# EAGLE design nano2 (EAGLE 8.3.0)

## Sheet 1 of 8
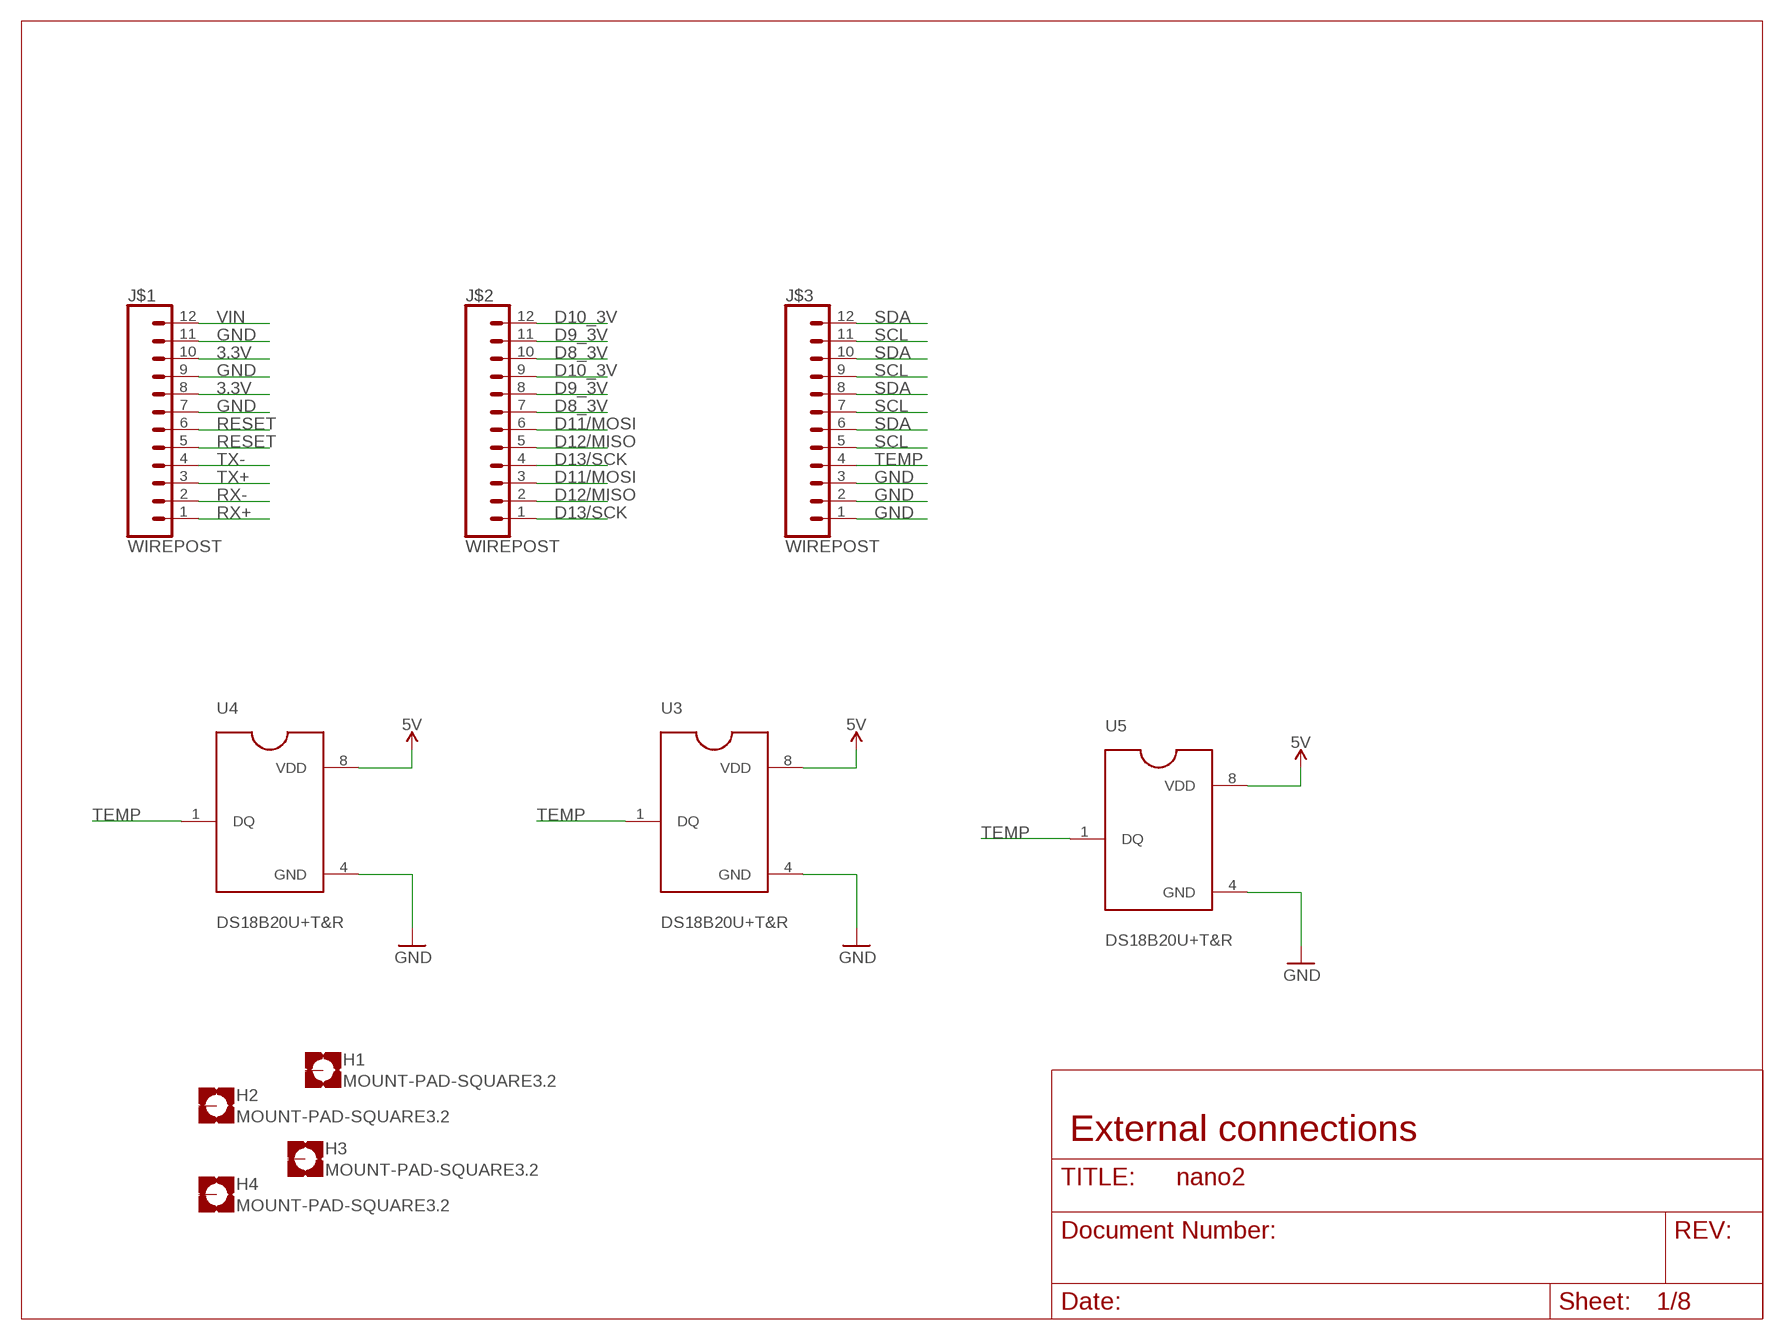
[diagram p0: schematic, sheet 1]

### Parts
H1  MOUNT-PAD-SQUARE3.2  [3,2-PAD-SQUARE]
H2  MOUNT-PAD-SQUARE3.2  [3,2-PAD-SQUARE]
H3  MOUNT-PAD-SQUARE3.2  [3,2-PAD-SQUARE]
H4  MOUNT-PAD-SQUARE3.2  [3,2-PAD-SQUARE]
J$1  WIREPOST  [WIREWRAPPOST]
J$2  WIREPOST  [WIREWRAPPOST]
J$3  WIREPOST  [WIREWRAPPOST]
U3  DS18B20U+T&R  [SOP65P500X110-8N]
U4  DS18B20U+T&R  [SOP65P500X110-8N]
U5  DS18B20U+T&R  [SOP65P500X110-8N]

### Nets
3.3V: J$1.8 J$1.10 ; also sheet 2,3,4,5,6,7,8
5V [power usb]: U3.8(VDD) U4.8(VDD) U5.8(VDD) ; supply symbol labelled POWER_5V ; also sheet 2,3,4,7,8
D8_3V: J$2.7 J$2.10 ; also sheet 7
D9_3V: J$2.8 J$2.11 ; also sheet 7
D10_3V: J$2.9 J$2.12 ; also sheet 7
D11/MOSI: J$2.3 J$2.6 ; also sheet 4,7
D12/MISO: J$2.2 J$2.5 ; also sheet 4,7
D13/SCK: J$2.1 J$2.4 ; also sheet 4,7
GND [gnd]: J$1.7 J$1.9 J$1.11 J$3.1 J$3.2 J$3.3 U3.4(GND) U4.4(GND) U5.4(GND) ; supply symbol labelled POWER_GND ; also sheet 2,3,4,5,6
RESET: J$1.5 J$1.6 ; also sheet 4
RX+: J$1.1 ; also sheet 2
RX-: J$1.2 ; also sheet 2
SCL: J$3.5 J$3.7 J$3.9 J$3.11 ; also sheet 4
SDA: J$3.6 J$3.8 J$3.10 J$3.12 ; also sheet 4
TEMP: J$3.4 U3.1(DQ) U4.1(DQ) U5.1(DQ)
TX+: J$1.3 ; also sheet 2
TX- [power]: J$1.4 ; also sheet 2
VIN [power]: J$1.12 ; also sheet 3
Unconnected: H1.B3,2(MOUNT) H2.B3,2(MOUNT) H3.B3,2(MOUNT) H4.B3,2(MOUNT)

### Notes on the sheet
- External connections

## Sheet 2 of 8
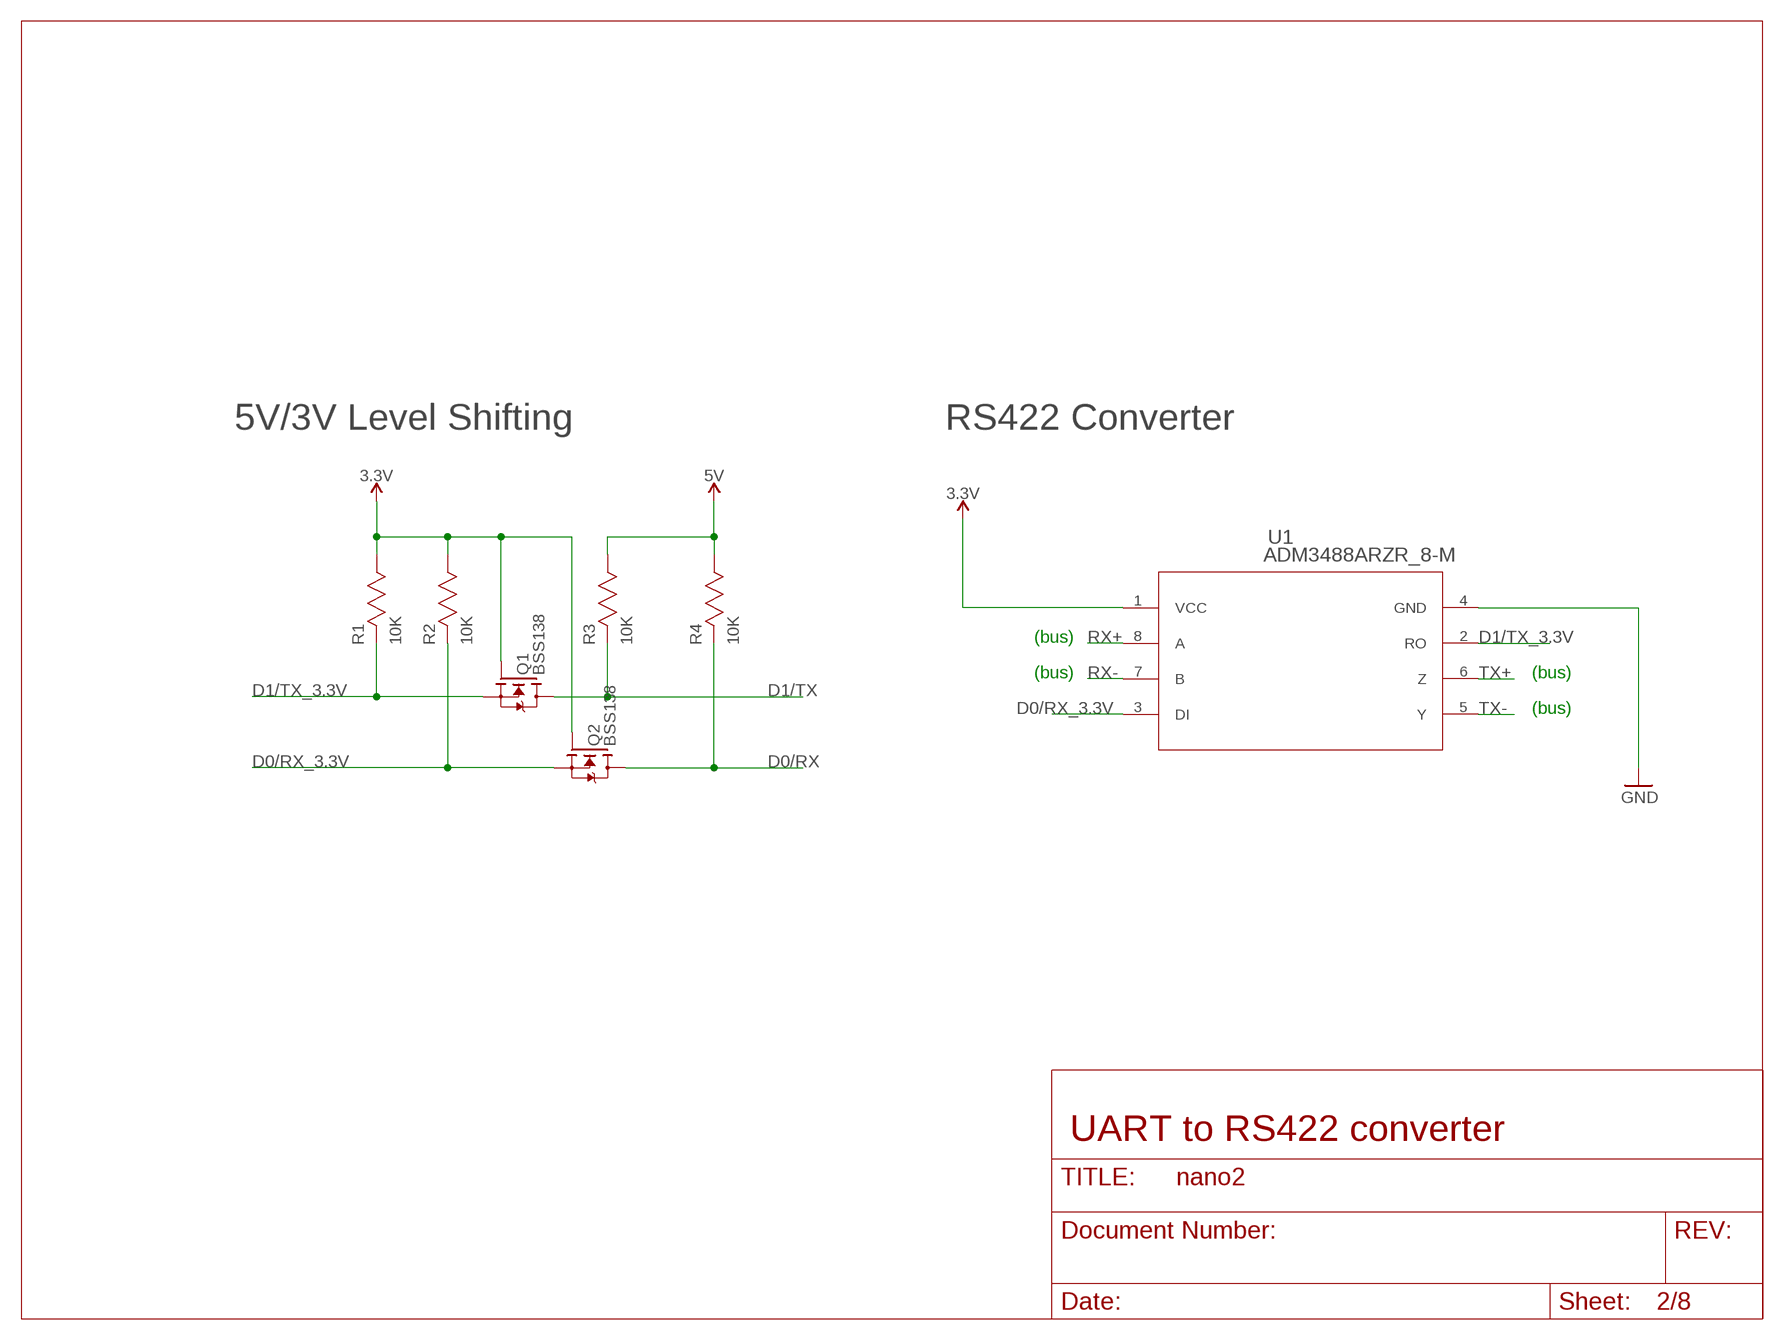
[diagram p1: schematic, sheet 2]

### Parts
Q1  BSS138  [SOT-23]
Q2  BSS138  [SOT-23]
R1  10K  RES_10K  [RC0603N]
R2  10K  RES_10K  [RC0603N]
R3  10K  RES_10K  [RC0603N]
R4  10K  RES_10K  [RC0603N]
U1  ADM3488ARZR_8-M  [R_8-M]

### Nets
3.3V: Q1.G Q2.G R1.1 R2.1 U1.1(VCC) ; supply symbol labelled POWER_3.3V ; also sheet 1,3,4,5,6,7,8
5V [power usb]: R3.1 R4.1 ; supply symbol labelled POWER_5V ; also sheet 1,3,4,7,8
D0/RX: Q2.D R4.2 ; also sheet 4
D0/RX_3.3V: Q2.S R2.2 U1.3(DI)
D1/TX: Q1.D R3.2 ; also sheet 4
D1/TX_3.3V: Q1.S R1.2 U1.2(RO)
GND [gnd]: U1.4(GND) ; supply symbol labelled POWER_GND ; also sheet 1,3,4,5,6
RX+: U1.8(A) ; also sheet 1
RX-: U1.7(B) ; also sheet 1
TX+: U1.6(Z) ; also sheet 1
TX- [power]: U1.5(Y) ; also sheet 1

### Notes on the sheet
- 5V/3V Level Shifting | RS422 Converter
- (bus)
- (bus) | (bus)
- (bus)
- UART to RS422 converter

## Sheet 3 of 8
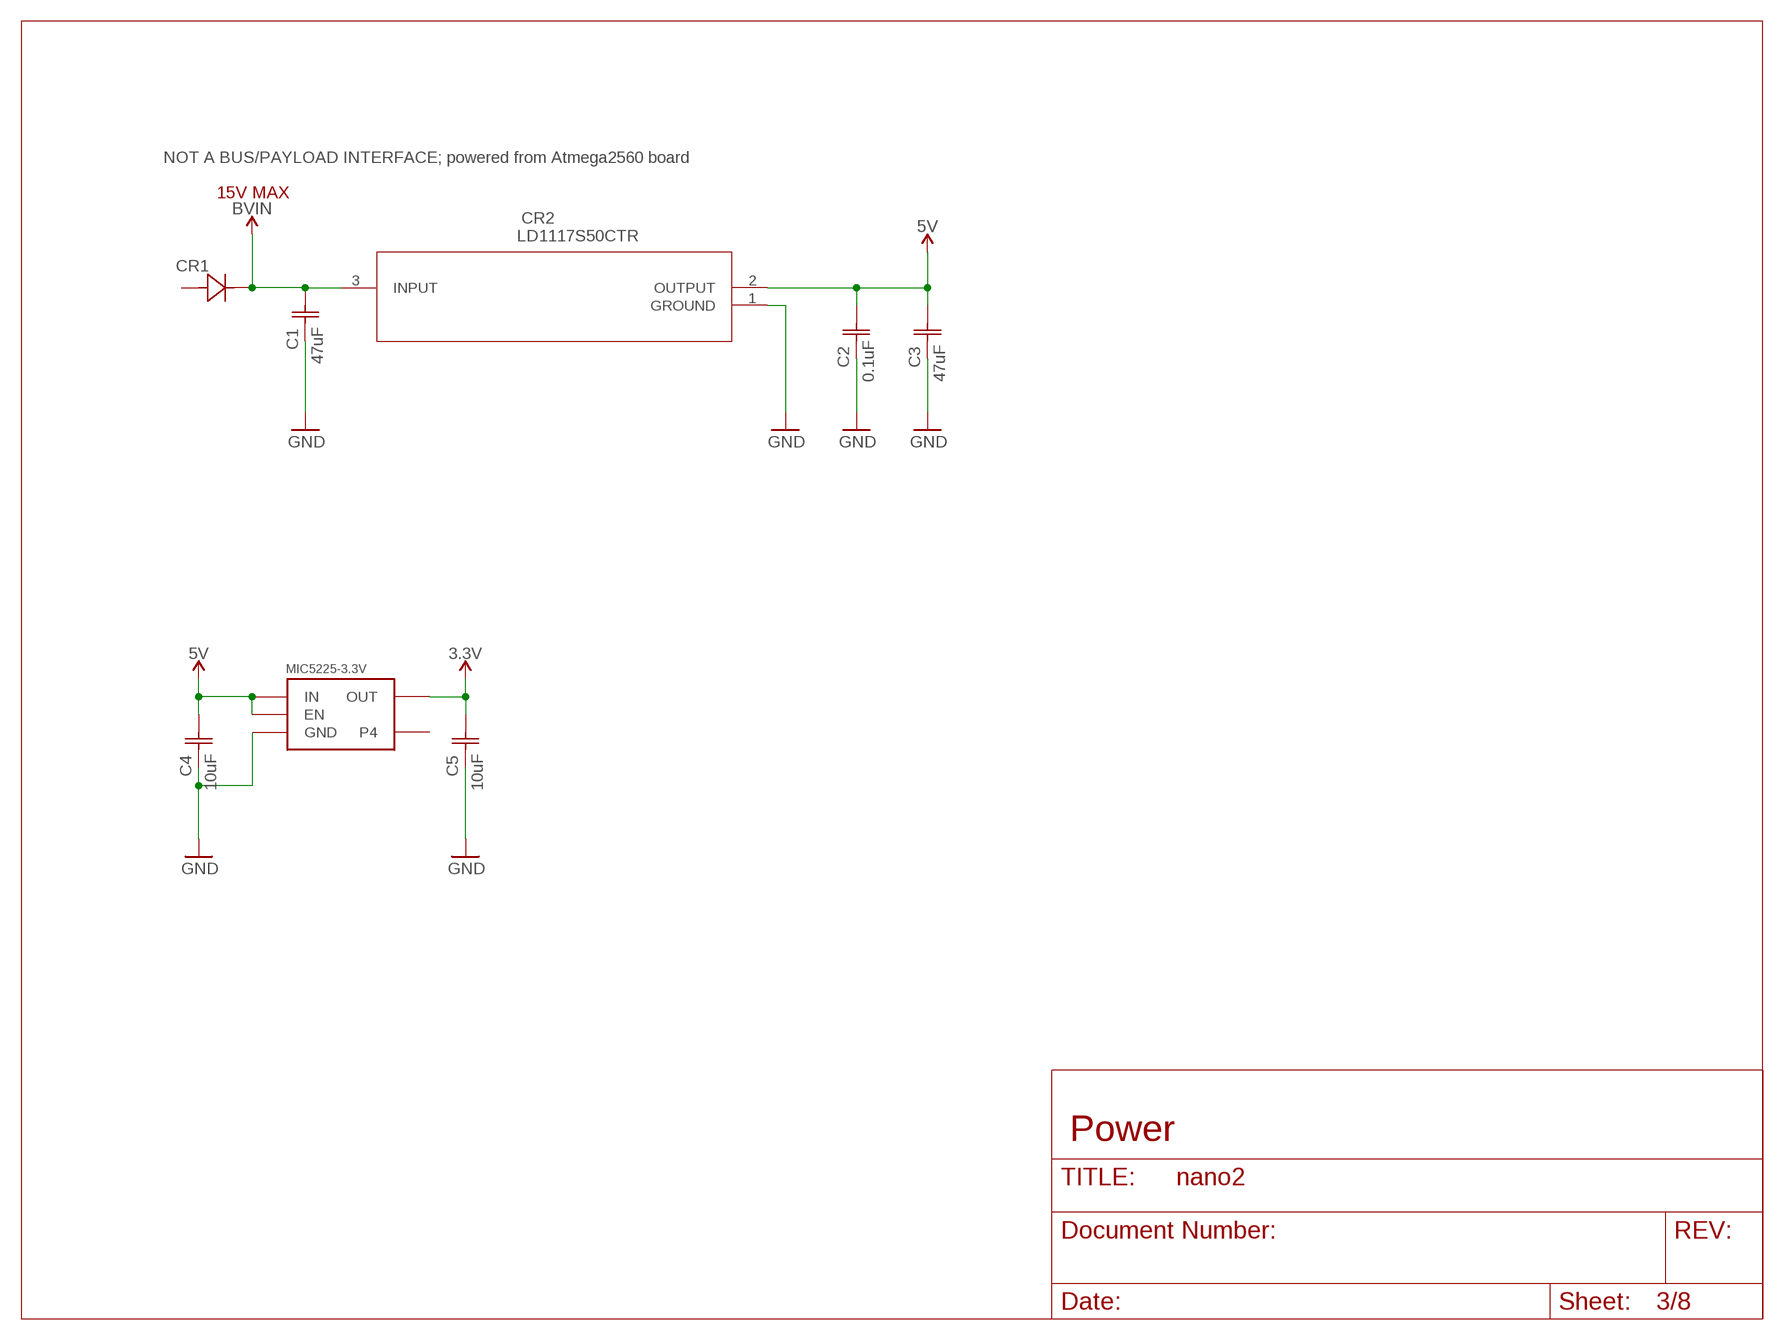
[diagram p2: schematic, sheet 3]

### Parts
C1  47uF  CAP_47UF  [CAP_5750]
C2  0.1uF  CAP_01UF  [CAP_01]
C3  47uF  CAP_47UF  [CAP_5750]
C4  10uF  CAP_10UF  [CAP_GRM219R61A106KE44D]
C5  10uF  CAP_10UF  [CAP_GRM219R61A106KE44D]
CR1  DIODE_600V_3A  [DIODE_600V_3A]
CR2  LD1117S50CTR  [SOT-223]
U2  MIC5225-3.3V  MIC5225  [SOT23-5]

### Nets
3.3V: C5.2 U2.OUT ; supply symbol labelled POWER_3.3V ; also sheet 1,2,4,5,6,7,8
5V [power usb]: C2.2 C3.2 C4.2 CR2.2(OUTPUT) U2.EN U2.IN ; supply symbol labelled POWER_5V ; also sheet 1,2,4,7,8
GND [gnd]: C1.1 C2.1 C3.1 C4.1 C5.1 CR2.1(GROUND) U2.GND ; supply symbol labelled POWER_GND ; also sheet 1,2,4,5,6
VIN [power]: C1.2 CR1.1 CR2.3(INPUT) ; also sheet 1
Unconnected: CR1.2 U2.NC/ADJ(P4)

### Notes on the sheet
- NOT A BUS/PAYLOAD INTERFACE; powered from Atmega2560 board
- 15V MAX
- Power

## Sheet 4 of 8
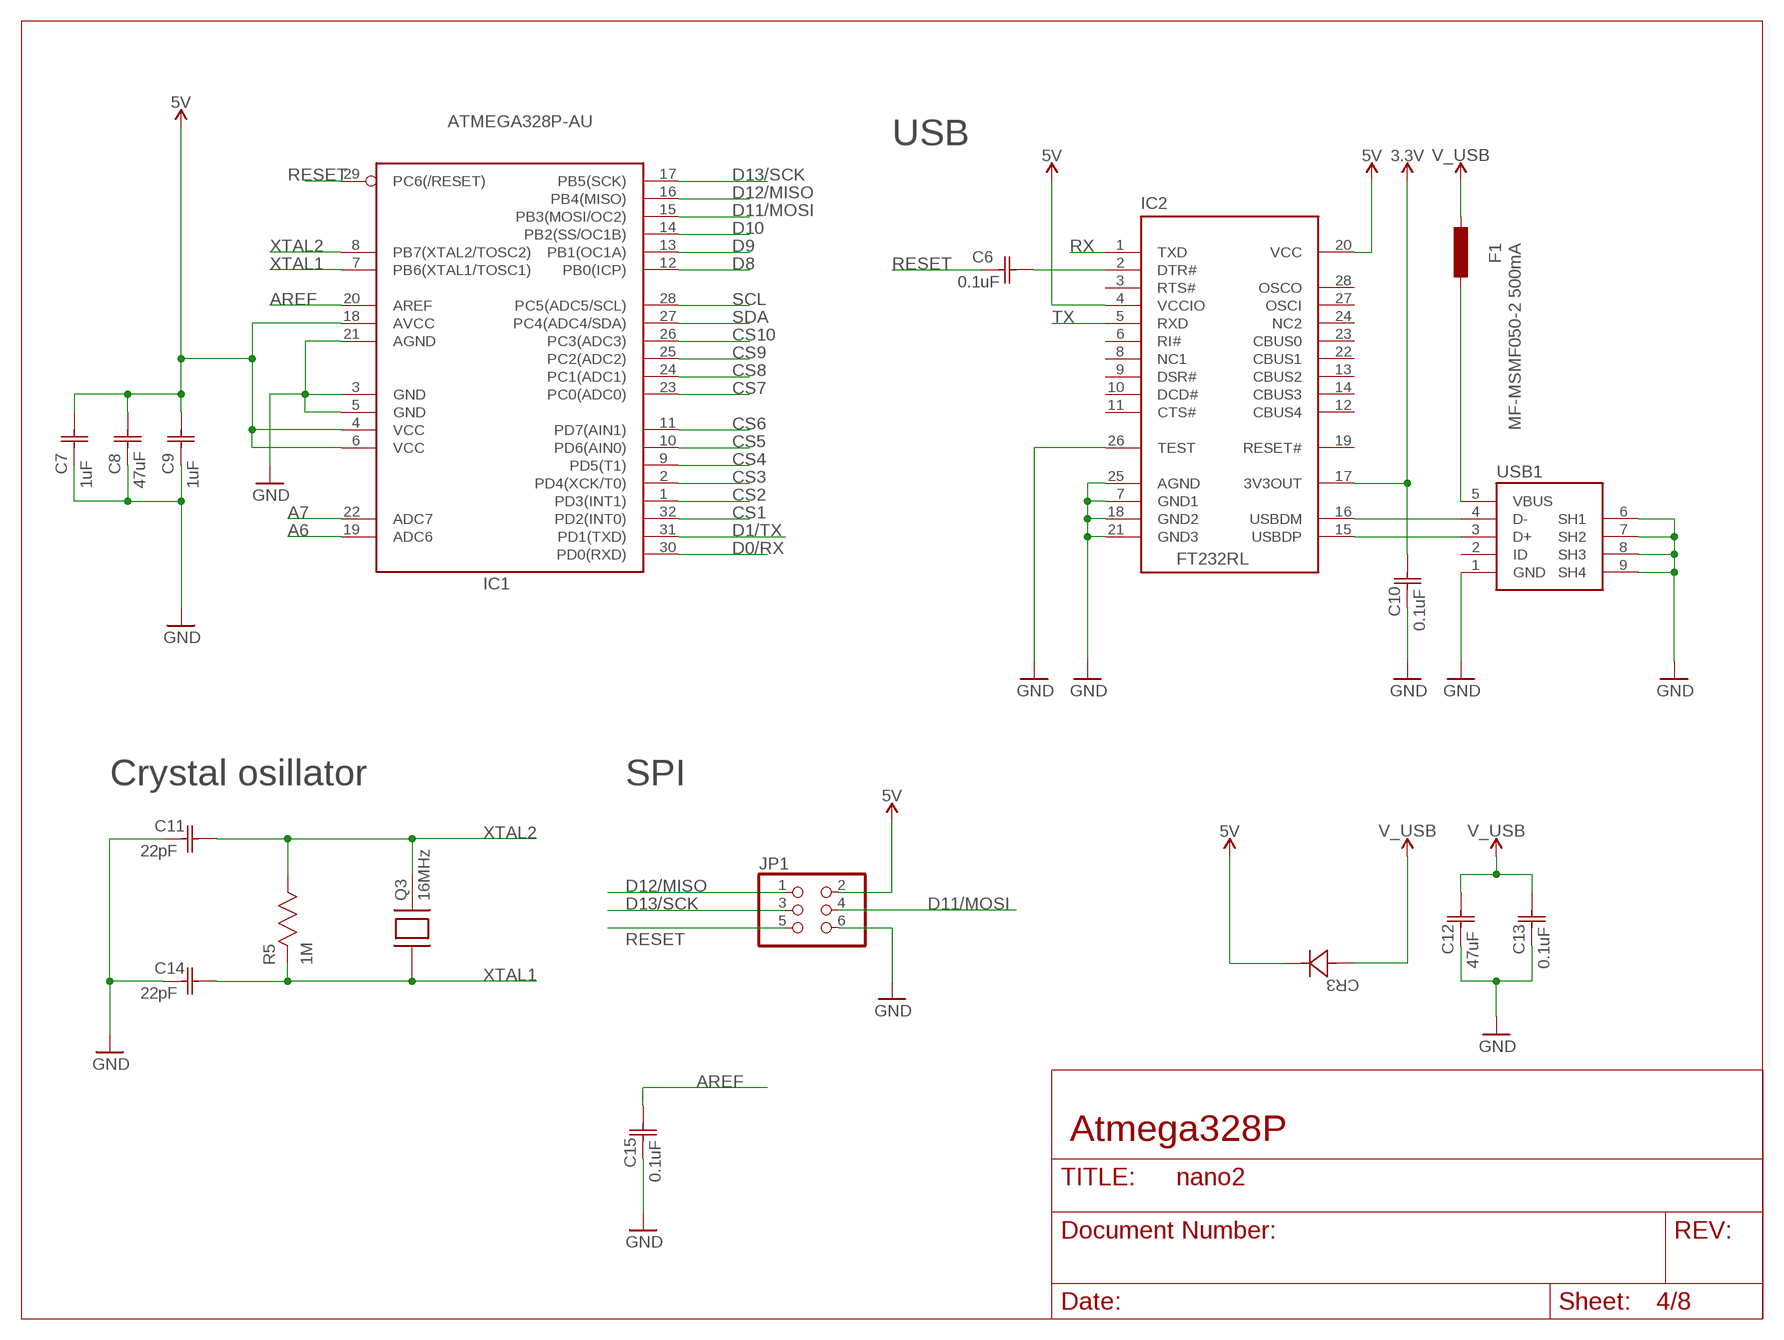
[diagram p3: schematic, sheet 4]

### Parts
C6  0.1uF  CAP_01UF  [CAP_01]
C7  1uF  CAP_1UF  [YAG_CC0805]
C8  47uF  CAP_47UF  [CAP_5750]
C9  1uF  CAP_1UF  [YAG_CC0805]
C10  0.1uF  CAP_01UF  [CAP_01]
C11  22pF  CAP_22PF  [CC0805N]
C12  47uF  CAP_47UF  [CAP_5750]
C13  0.1uF  CAP_01UF  [CAP_01]
C14  22pF  CAP_22PF  [CC0805N]
C15  0.1uF  CAP_01UF  [CAP_01]
CR3  DIODE_600V_3A  [DIODE_600V_3A]
F1  MF-MSMF050-2 500mA  0002_MF-MSMF050-2  [L1812]
IC1  ATMEGA328P-AU  0265_ATMEGA328P-AU  [TQFP32-08]
IC2  FT232RL  0226_FT232RL  [SSOP28]
JP1  0114_PH254-203DF118A00V  [2X03]
Q3  16MHz  OSILLATOR  [OSCILLATOR]
R5  1M  RES_1M  [RC0603N]
USB1  0219_14850  [USB-MINI-B_2]

### Nets
3.3V: C10.2 IC2.17(3V3OUT) ; supply symbol labelled POWER_3.3V ; also sheet 1,2,3,5,6,7,8
5V [power usb]: C7.2 C8.2 C9.2 CR3.1 IC1.4(VCC) IC1.6(VCC) IC1.18(AVCC) IC2.4(VCCIO) IC2.20(VCC) JP1.2 ; supply symbol labelled POWER_5V ; also sheet 1,2,3,7,8
A6: IC1.19(ADC6)
A7: IC1.22(ADC7)
AREF: C15.2 IC1.20(AREF)
CS1: IC1.32(PD2(INT0)) ; also sheet 8
CS2: IC1.1(PD3(INT1)) ; also sheet 8
CS3: IC1.2(PD4(XCK/T0)) ; also sheet 8
CS4: IC1.9(PD5(T1)) ; also sheet 8
CS5: IC1.10(PD6(AIN0)) ; also sheet 8
CS6: IC1.11(PD7(AIN1)) ; also sheet 8
CS7: IC1.23(PC0(ADC0)) ; also sheet 8
CS8: IC1.24(PC1(ADC1)) ; also sheet 8
CS9: IC1.25(PC2(ADC2)) ; also sheet 8
CS10: IC1.26(PC3(ADC3)) ; also sheet 8
D0/RX: IC1.30(PD0(RXD)) ; also sheet 2
D1/TX: IC1.31(PD1(TXD)) ; also sheet 2
D8: IC1.12(PB0(ICP)) ; also sheet 7
D9: IC1.13(PB1(OC1A)) ; also sheet 7
D10: IC1.14(PB2(SS/OC1B)) ; also sheet 7
D11/MOSI: IC1.15(PB3(MOSI/OC2)) JP1.4 ; also sheet 1,7
D12/MISO: IC1.16(PB4(MISO)) JP1.1 ; also sheet 1,7
D13/SCK: IC1.17(PB5(SCK)) JP1.3 ; also sheet 1,7
GND [gnd]: C7.1 C8.1 C9.1 C10.1 C11.1 C12.1 C13.1 C14.1 C15.1 IC1.3(GND) IC1.5(GND) IC1.21(AGND) IC2.7(GND1) IC2.18(GND2) IC2.21(GND3) IC2.25(AGND) IC2.26(TEST) JP1.6 USB1.1(GND) USB1.6(SH1) USB1.7(SH2) USB1.8(SH3) USB1.9(SH4) ; supply symbol labelled POWER_GND ; also sheet 1,2,3,5,6
N$1: F1.2 USB1.5(VBUS)
N$21: C6.2 IC2.2(DTR#)
N$22: IC2.15(USBDP) USB1.3(D+)
N$23: IC2.16(USBDM) USB1.4(D-)
RESET: C6.1 IC1.29(PC6(/RESET)) JP1.5 ; also sheet 1
RX: IC2.1(TXD)
SCL: IC1.28(PC5(ADC5/SCL)) ; also sheet 1
SDA: IC1.27(PC4(ADC4/SDA)) ; also sheet 1
TX: IC2.5(RXD)
V_USB: C12.2 C13.2 CR3.2 F1.1
XTAL1: C14.2 IC1.7(PB6(XTAL1/TOSC1)) Q3.1 R5.2
XTAL2: C11.2 IC1.8(PB7(XTAL2/TOSC2)) Q3.2 R5.1
Unconnected: IC2.3(RTS#) IC2.6(RI#) IC2.8(NC1) IC2.9(DSR#) IC2.10(DCD#) IC2.11(CTS#) IC2.12(CBUS4) IC2.13(CBUS2) IC2.14(CBUS3) IC2.19(RESET#) IC2.22(CBUS1) IC2.23(CBUS0) IC2.24(NC2) IC2.27(OSCI) IC2.28(OSCO) USB1.2(ID)

### Notes on the sheet
- USB
- Crystal osillator | SPI
- Atmega328P

## Sheet 5 of 8
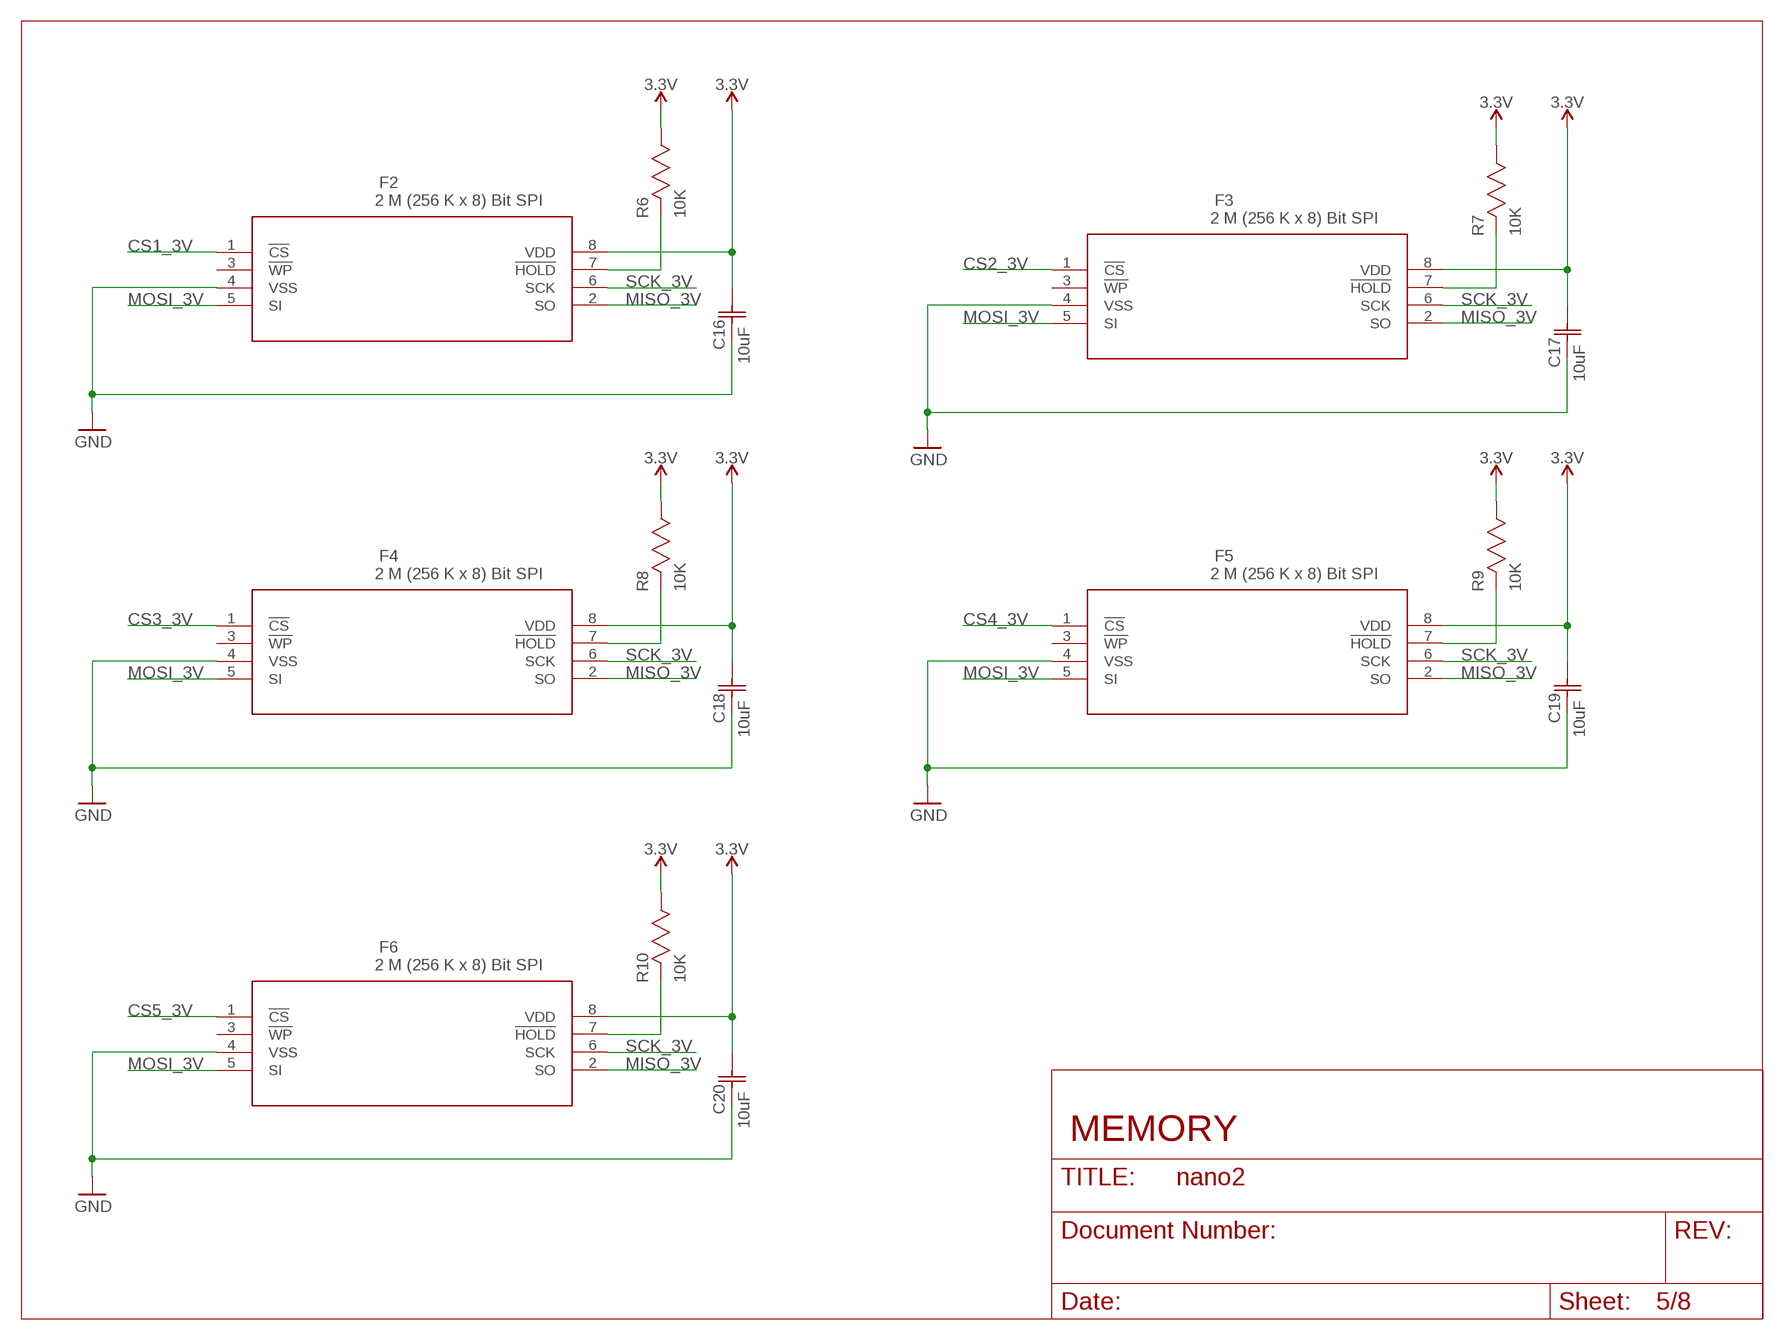
[diagram p4: schematic, sheet 5]

### Parts
C16  10uF  CAP_10UF  [CAP_GRM219R61A106KE44D]
C17  10uF  CAP_10UF  [CAP_GRM219R61A106KE44D]
C18  10uF  CAP_10UF  [CAP_GRM219R61A106KE44D]
C19  10uF  CAP_10UF  [CAP_GRM219R61A106KE44D]
C20  10uF  CAP_10UF  [CAP_GRM219R61A106KE44D]
F2  2 M (256 K x 8) Bit SPI  FRAM_MB85RS2MTA  [FRAM_MB85RS2MTA_FPT-8P-M09]
F3  2 M (256 K x 8) Bit SPI  FRAM_MB85RS2MTA  [FRAM_MB85RS2MTA_FPT-8P-M09]
F4  2 M (256 K x 8) Bit SPI  FRAM_MB85RS2MTA  [FRAM_MB85RS2MTA_FPT-8P-M09]
F5  2 M (256 K x 8) Bit SPI  FRAM_MB85RS2MTA  [FRAM_MB85RS2MTA_FPT-8P-M09]
F6  2 M (256 K x 8) Bit SPI  FRAM_MB85RS2MTA  [FRAM_MB85RS2MTA_FPT-8P-M09]
R6  10K  RES_10K  [RC0603N]
R7  10K  RES_10K  [RC0603N]
R8  10K  RES_10K  [RC0603N]
R9  10K  RES_10K  [RC0603N]
R10  10K  RES_10K  [RC0603N]

### Nets
3.3V: C16.2 C17.2 C18.2 C19.2 C20.2 F2.8(VDD) F3.8(VDD) F4.8(VDD) F5.8(VDD) F6.8(VDD) R6.1 R7.1 R8.1 R9.1 R10.1 ; supply symbol labelled POWER_3.3V ; also sheet 1,2,3,4,6,7,8
CS1_3V: F2.1(!CS) ; also sheet 8
CS2_3V: F3.1(!CS) ; also sheet 8
CS3_3V: F4.1(!CS) ; also sheet 8
CS4_3V: F5.1(!CS) ; also sheet 8
CS5_3V: F6.1(!CS) ; also sheet 8
GND [gnd]: C16.1 C17.1 C18.1 C19.1 C20.1 F2.4(VSS) F3.4(VSS) F4.4(VSS) F5.4(VSS) F6.4(VSS) ; supply symbol labelled POWER_GND ; also sheet 1,2,3,4,6
MISO_3V: F2.2(SO) F3.2(SO) F4.2(SO) F5.2(SO) F6.2(SO) ; also sheet 6,7
MOSI_3V: F2.5(SI) F3.5(SI) F4.5(SI) F5.5(SI) F6.5(SI) ; also sheet 6,7
N$2: F2.7(!HOLD) R6.2
N$7: F4.7(!HOLD) R8.2
N$8: F6.7(!HOLD) R10.2
N$10: F3.7(!HOLD) R7.2
N$17: F5.7(!HOLD) R9.2
SCK_3V: F2.6(SCK) F3.6(SCK) F4.6(SCK) F5.6(SCK) F6.6(SCK) ; also sheet 6,7
Unconnected: F2.3(!WP) F3.3(!WP) F4.3(!WP) F5.3(!WP) F6.3(!WP)

### Notes on the sheet
- MEMORY

## Sheet 6 of 8
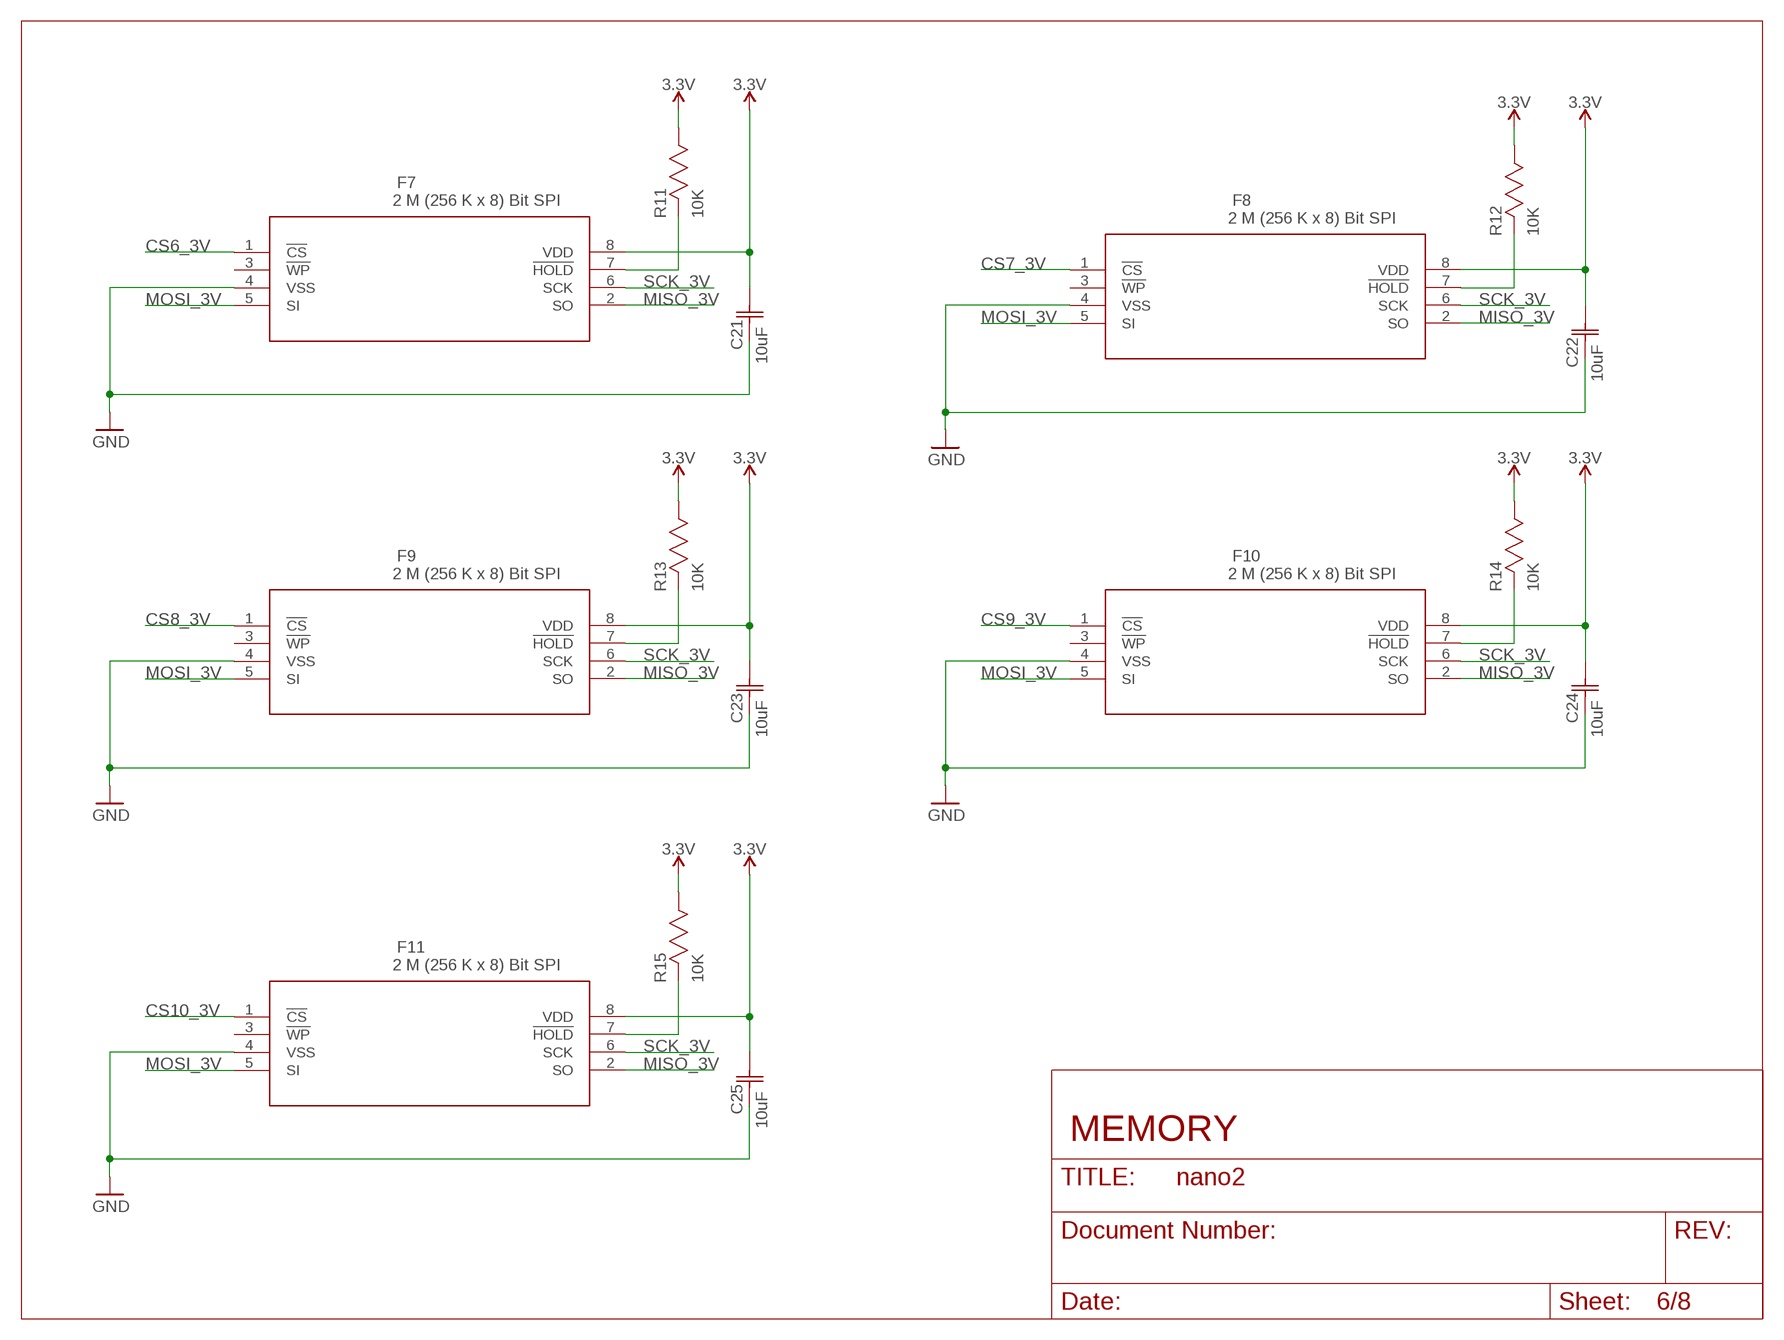
[diagram p5: schematic, sheet 6]

### Parts
C21  10uF  CAP_10UF  [CAP_GRM219R61A106KE44D]
C22  10uF  CAP_10UF  [CAP_GRM219R61A106KE44D]
C23  10uF  CAP_10UF  [CAP_GRM219R61A106KE44D]
C24  10uF  CAP_10UF  [CAP_GRM219R61A106KE44D]
C25  10uF  CAP_10UF  [CAP_GRM219R61A106KE44D]
F7  2 M (256 K x 8) Bit SPI  FRAM_MB85RS2MTA  [FRAM_MB85RS2MTA_FPT-8P-M09]
F8  2 M (256 K x 8) Bit SPI  FRAM_MB85RS2MTA  [FRAM_MB85RS2MTA_FPT-8P-M09]
F9  2 M (256 K x 8) Bit SPI  FRAM_MB85RS2MTA  [FRAM_MB85RS2MTA_FPT-8P-M09]
F10  2 M (256 K x 8) Bit SPI  FRAM_MB85RS2MTA  [FRAM_MB85RS2MTA_FPT-8P-M09]
F11  2 M (256 K x 8) Bit SPI  FRAM_MB85RS2MTA  [FRAM_MB85RS2MTA_FPT-8P-M09]
R11  10K  RES_10K  [RC0603N]
R12  10K  RES_10K  [RC0603N]
R13  10K  RES_10K  [RC0603N]
R14  10K  RES_10K  [RC0603N]
R15  10K  RES_10K  [RC0603N]

### Nets
3.3V: C21.2 C22.2 C23.2 C24.2 C25.2 F7.8(VDD) F8.8(VDD) F9.8(VDD) F10.8(VDD) F11.8(VDD) R11.1 R12.1 R13.1 R14.1 R15.1 ; supply symbol labelled POWER_3.3V ; also sheet 1,2,3,4,5,7,8
CS6_3V: F7.1(!CS) ; also sheet 8
CS7_3V: F8.1(!CS) ; also sheet 8
CS8_3V: F9.1(!CS) ; also sheet 8
CS9_3V: F10.1(!CS) ; also sheet 8
CS10_3V: F11.1(!CS) ; also sheet 8
GND [gnd]: C21.1 C22.1 C23.1 C24.1 C25.1 F7.4(VSS) F8.4(VSS) F9.4(VSS) F10.4(VSS) F11.4(VSS) ; supply symbol labelled POWER_GND ; also sheet 1,2,3,4,5
MISO_3V: F7.2(SO) F8.2(SO) F9.2(SO) F10.2(SO) F11.2(SO) ; also sheet 5,7
MOSI_3V: F7.5(SI) F8.5(SI) F9.5(SI) F10.5(SI) F11.5(SI) ; also sheet 5,7
N$15: F7.7(!HOLD) R11.2
N$16: F9.7(!HOLD) R13.2
N$18: F11.7(!HOLD) R15.2
N$19: F8.7(!HOLD) R12.2
N$20: F10.7(!HOLD) R14.2
SCK_3V: F7.6(SCK) F8.6(SCK) F9.6(SCK) F10.6(SCK) F11.6(SCK) ; also sheet 5,7
Unconnected: F7.3(!WP) F8.3(!WP) F9.3(!WP) F10.3(!WP) F11.3(!WP)

### Notes on the sheet
- MEMORY

## Sheet 7 of 8
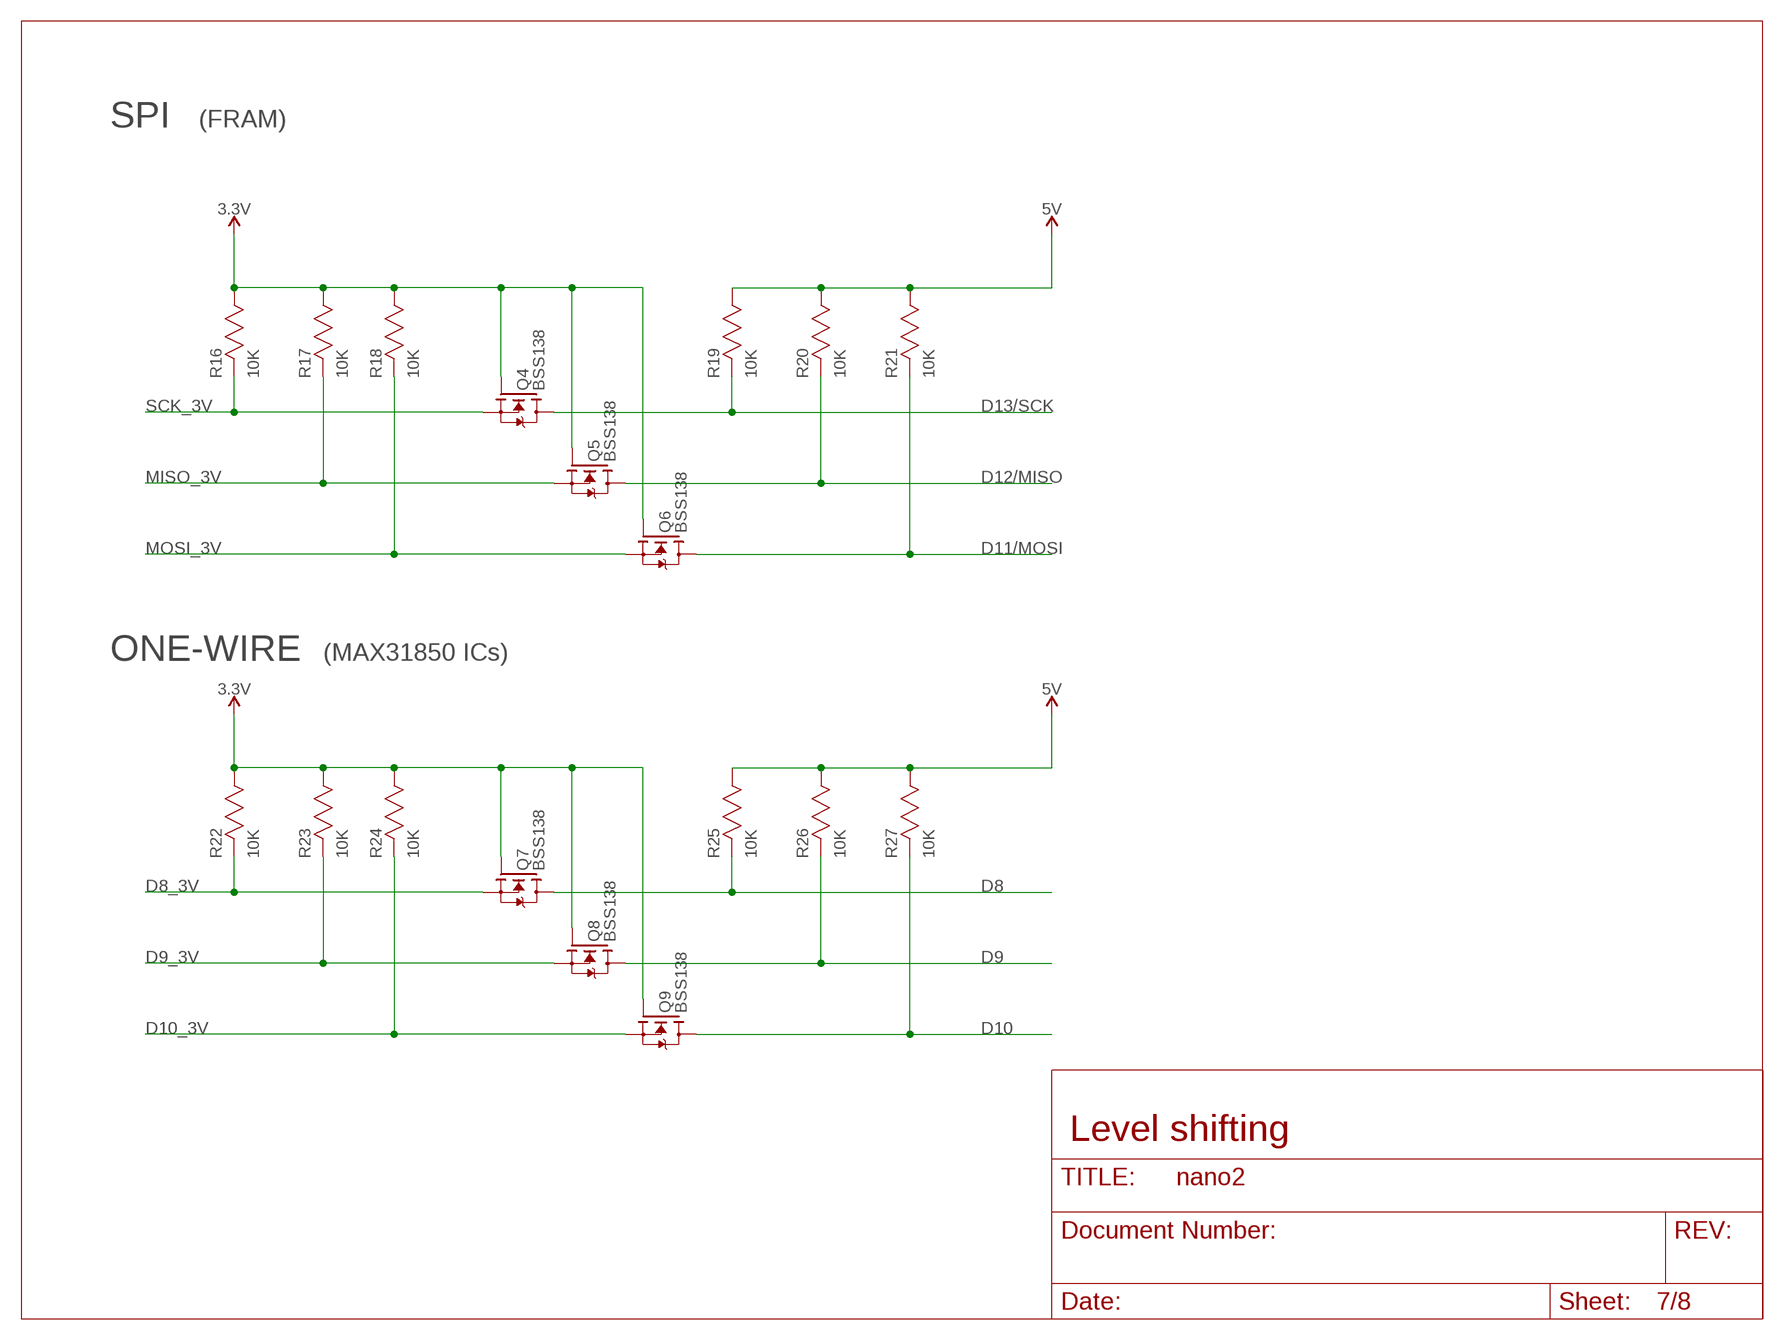
[diagram p6: schematic, sheet 7]

### Parts
Q4  BSS138  [SOT-23]
Q5  BSS138  [SOT-23]
Q6  BSS138  [SOT-23]
Q7  BSS138  [SOT-23]
Q8  BSS138  [SOT-23]
Q9  BSS138  [SOT-23]
R16  10K  RES_10K  [RC0603N]
R17  10K  RES_10K  [RC0603N]
R18  10K  RES_10K  [RC0603N]
R19  10K  RES_10K  [RC0603N]
R20  10K  RES_10K  [RC0603N]
R21  10K  RES_10K  [RC0603N]
R22  10K  RES_10K  [RC0603N]
R23  10K  RES_10K  [RC0603N]
R24  10K  RES_10K  [RC0603N]
R25  10K  RES_10K  [RC0603N]
R26  10K  RES_10K  [RC0603N]
R27  10K  RES_10K  [RC0603N]

### Nets
3.3V: Q4.G Q5.G Q6.G Q7.G Q8.G Q9.G R16.1 R17.1 R18.1 R22.1 R23.1 R24.1 ; supply symbol labelled POWER_3.3V ; also sheet 1,2,3,4,5,6,8
5V [power usb]: R19.1 R20.1 R21.1 R25.1 R26.1 R27.1 ; supply symbol labelled POWER_5V ; also sheet 1,2,3,4,8
D8: Q7.D R25.2 ; also sheet 4
D8_3V: Q7.S R22.2 ; also sheet 1
D9: Q8.D R26.2 ; also sheet 4
D9_3V: Q8.S R23.2 ; also sheet 1
D10: Q9.D R27.2 ; also sheet 4
D10_3V: Q9.S R24.2 ; also sheet 1
D11/MOSI: Q6.D R21.2 ; also sheet 1,4
D12/MISO: Q5.D R20.2 ; also sheet 1,4
D13/SCK: Q4.D R19.2 ; also sheet 1,4
MISO_3V: Q5.S R17.2 ; also sheet 5,6
MOSI_3V: Q6.S R18.2 ; also sheet 5,6
SCK_3V: Q4.S R16.2 ; also sheet 5,6

### Notes on the sheet
- SPI | (FRAM)
- ONE-WIRE | (MAX31850 ICs)
- Level shifting

## Sheet 8 of 8
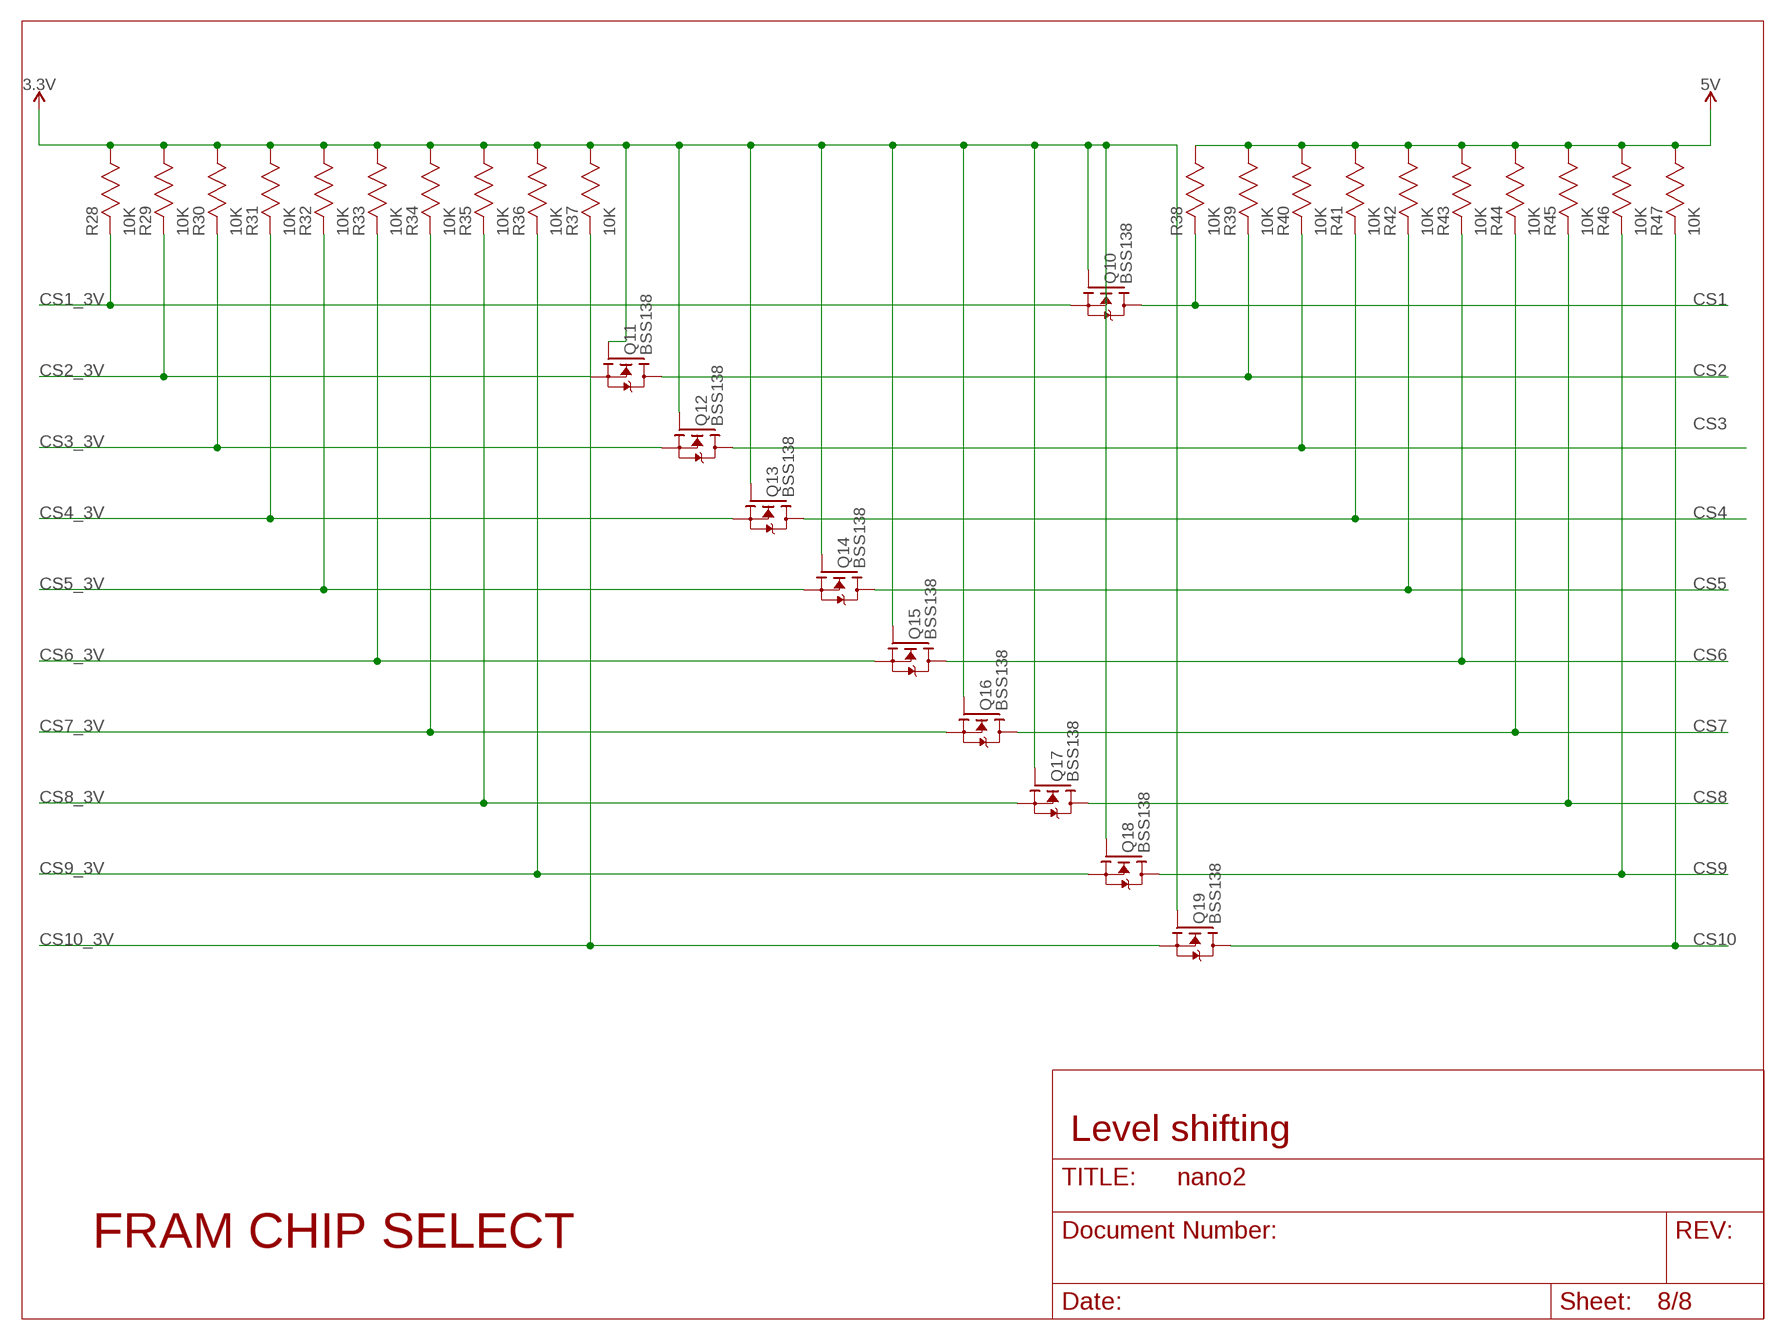
[diagram p7: schematic, sheet 8]

### Parts
Q10  BSS138  [SOT-23]
Q11  BSS138  [SOT-23]
Q12  BSS138  [SOT-23]
Q13  BSS138  [SOT-23]
Q14  BSS138  [SOT-23]
Q15  BSS138  [SOT-23]
Q16  BSS138  [SOT-23]
Q17  BSS138  [SOT-23]
Q18  BSS138  [SOT-23]
Q19  BSS138  [SOT-23]
R28  10K  RES_10K  [RC0603N]
R29  10K  RES_10K  [RC0603N]
R30  10K  RES_10K  [RC0603N]
R31  10K  RES_10K  [RC0603N]
R32  10K  RES_10K  [RC0603N]
R33  10K  RES_10K  [RC0603N]
R34  10K  RES_10K  [RC0603N]
R35  10K  RES_10K  [RC0603N]
R36  10K  RES_10K  [RC0603N]
R37  10K  RES_10K  [RC0603N]
R38  10K  RES_10K  [RC0603N]
R39  10K  RES_10K  [RC0603N]
R40  10K  RES_10K  [RC0603N]
R41  10K  RES_10K  [RC0603N]
R42  10K  RES_10K  [RC0603N]
R43  10K  RES_10K  [RC0603N]
R44  10K  RES_10K  [RC0603N]
R45  10K  RES_10K  [RC0603N]
R46  10K  RES_10K  [RC0603N]
R47  10K  RES_10K  [RC0603N]

### Nets
3.3V: Q10.G Q11.G Q12.G Q13.G Q14.G Q15.G Q16.G Q17.G Q18.G Q19.G R28.1 R29.1 R30.1 R31.1 R32.1 R33.1 R34.1 R35.1 R36.1 R37.1 ; supply symbol labelled POWER_3.3V ; also sheet 1,2,3,4,5,6,7
5V [power usb]: R38.1 R39.1 R40.1 R41.1 R42.1 R43.1 R44.1 R45.1 R46.1 R47.1 ; supply symbol labelled POWER_5V ; also sheet 1,2,3,4,7
CS1: Q10.D R38.2 ; also sheet 4
CS1_3V: Q10.S R28.2 ; also sheet 5
CS2: Q11.D R39.2 ; also sheet 4
CS2_3V: Q11.S R29.2 ; also sheet 5
CS3: Q12.D R40.2 ; also sheet 4
CS3_3V: Q12.S R30.2 ; also sheet 5
CS4: Q13.D R41.2 ; also sheet 4
CS4_3V: Q13.S R31.2 ; also sheet 5
CS5: Q14.D R42.2 ; also sheet 4
CS5_3V: Q14.S R32.2 ; also sheet 5
CS6: Q15.D R43.2 ; also sheet 4
CS6_3V: Q15.S R33.2 ; also sheet 6
CS7: Q16.D R44.2 ; also sheet 4
CS7_3V: Q16.S R34.2 ; also sheet 6
CS8: Q17.D R45.2 ; also sheet 4
CS8_3V: Q17.S R35.2 ; also sheet 6
CS9: Q18.D R46.2 ; also sheet 4
CS9_3V: Q18.S R36.2 ; also sheet 6
CS10: Q19.D R47.2 ; also sheet 4
CS10_3V: Q19.S R37.2 ; also sheet 6

### Notes on the sheet
- Level shifting
- FRAM CHIP SELECT

## Library data of the parts
C1 C3 C8 C12 = cubesat_:CAP_47UF: CGA9N3X7R1C476M230KB Digikey 445-7935-1-ND; MANUFACTURER_PART_NUMBER: CGA9N3X7R1C476M230KB; VENDOR: TDK
C2 C6 C10 C13 C15 = cubesat_:CAP_01UF: Digikey 311-1336-1-ND; MANUFACTURER_PART_NUMBER: CC0402KRX5R6BB104; VENDOR: Yageo
C4 C5 C16-C25 = cubesat_:CAP_10UF: GRM219R61A106KE44D Digikey 490-4735-1-ND
C7 C9 = cubesat_:CAP_1UF: Digikey 311-1365-1-ND; MANUFACTURER_PART_NUMBER: CC0805KKX7R7BB105; VENDOR: Yageo
C11 C14 = cubesat_:CAP_22PF: Digikey 399-1113-1-ND
CR1 CR3 = cubesat_:DIODE_600V_3A: Digikey RS3JB-FDICT-ND; MANUFACTURER_PART_NUMBER: RS3JB13F; VENDOR: Diodes Inc
CR2 = cubesat_:LD1117S50CTR: Digikey 497-1243-1-ND; MANUFACTURER_PART_NUMBER: LD1117S50CTR; VENDOR: STMicroelectronics
F1 = Protezione:0002_MF-MSMF050-2: 500 mA Multifuse � Polyfuse; MONTHLY_USAGE: _____; PART_NUMBER: MF-MSMF050-2; PRICE: _____; SUPPLIER: _____; TYPE: Protezione
F2-F11 = cubesat_:FRAM_MB85RS2MTA: Digi-Key Part Number 865-1286-6-ND
H1-H4 = holes:MOUNT-PAD-SQUARE: MOUNTING PAD, square
IC1 = IntegratedCircuits:0265_ATMEGA328P-AU: 8-bit Microcontroller with 32KBytes In-System Programmable Flash ATMEGA328P-AU; CASE: TQFP32_7x7; MONTHLY_USAGE: _____; PART_NUMBER: ATMEGA328P-AU; PRICE: _____; SUPPLIER: _____; TYPE: Circuito_Integrato
IC2 = IntegratedCircuits:0226_FT232RL: USB to serial UART interface -FT232RL; CASE: SSOP28; MONTHLY_USAGE: _____; PART_NUMBER: FT232RL; PRICE: _____; SUPPLIER: _____; TYPE: Circuito_Integrato
J$1-J$3 = cubesat:WIREPOST
JP1 = Connettori:0114_PH254-203DF118A00V: 3x2 M V h 8,5 mm p2,54; MONTHLY_USAGE: _____; PART_NUMBER: PH254-203DF118A00V; PRICE: _____; SUPPLIER: _____; TYPE: Connettori; VALUE: ICSP
Q1 Q2 Q4-Q19 = cubesat_:BSS138: Digikey BSS138CT-ND; MANUFACTURER_PART_NUMBER: BSS138TA; VENDOR: Diodes Inc
Q3 = cubesat_:OSILLATOR: Digikey 535-9948-1-ND
R1-R4 R6-R47 = cubesat_:RES_10K: Digikey 311-10KGRCT-ND
R5 = cubesat_:RES_1M: Digikey 311-1.00MHRCT-ND
U1 = ADM3488ARZ:ADM3488ARZ; MANUFACTURER_PART_NUMBER: ADM3488ARZ; VENDOR: Analog Devices Inc
U2 = cubesat_:MIC5225: Digikey 576-2980-2-ND
U3-U5 = cubesat_:DS18B20U+T&R: Programmable Resolution 1-Wire Digital Thermometer; AVAILABILITY: Good; DESCRIPTION: Temp Sensor Digital Serial (1-Wire) 8-Pin uMAX T/R; MF: Maxim Integrated; MP: DS18B20U+T&amp;R; PACKAGE: MSOP-8 Maxim Integrated; PRICE: 2.79 USD
USB1 = Connettori:0219_14850: Usb-Mini F 90 Smd; MONTHLY_USAGE: _____; PART_NUMBER: 14850; PRICE: _____; SUPPLIER: _____; TYPE: Connettori; VALUE: USB-mini-90 -SMD

## Net classes
1 power: width 0.254 mm
2 gnd: width 0.305 mm, drill 0.406 mm, clearance 0.205 mm to class 0, clearance 0.205 mm to class 1, clearance 0.205 mm
3 power usb: width 0.508 mm, drill 0.406 mm, clearance 0.205 mm to class 0, clearance 0.205 mm to class 1, clearance 0.205 mm to class 2, clearance 0.205 mm

## Board
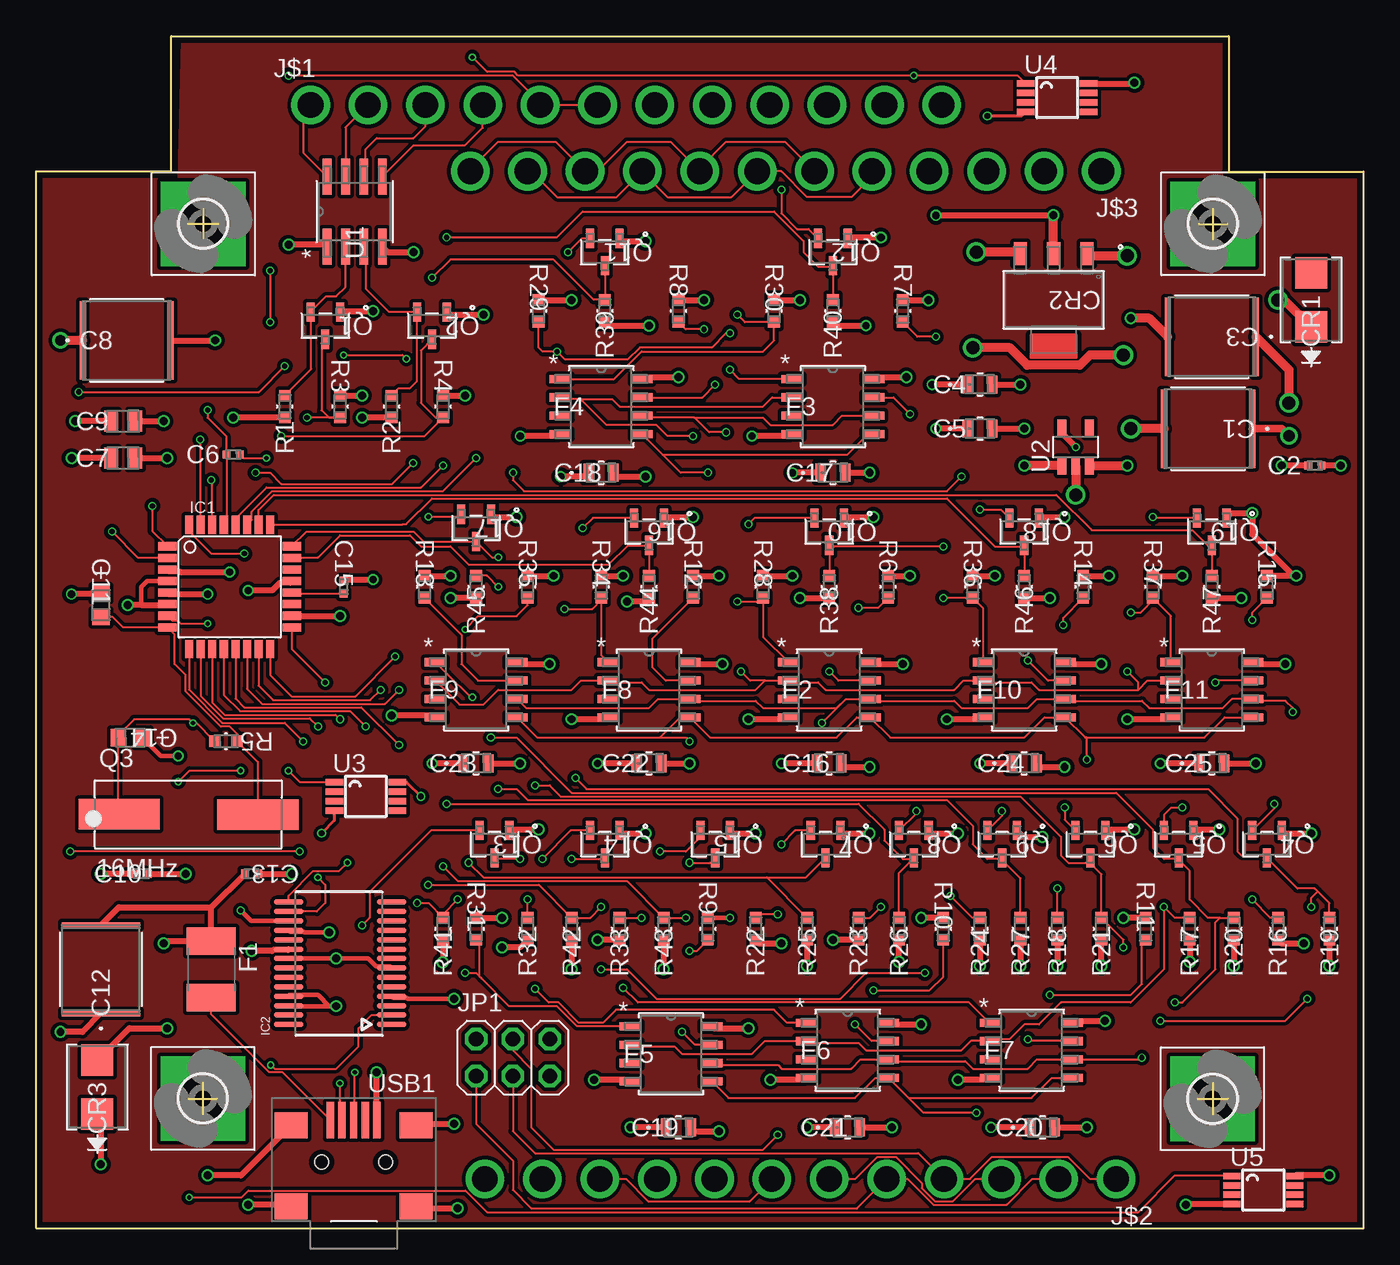
[diagram p8: board, top side]
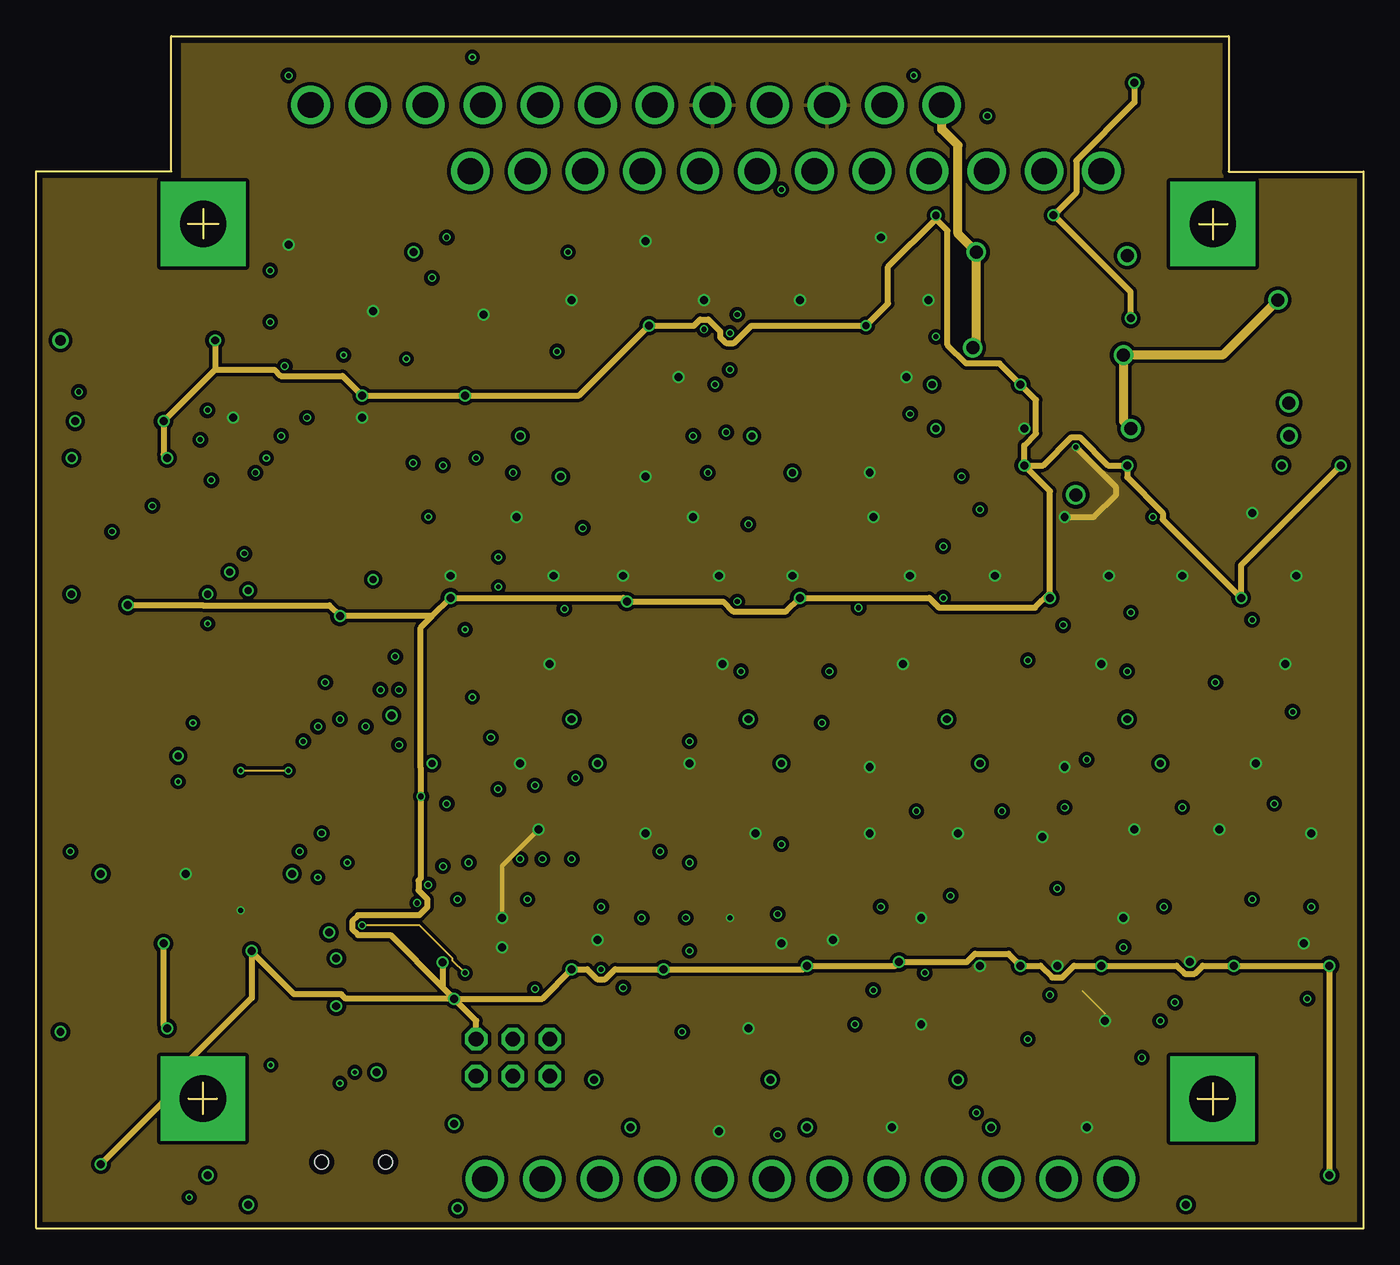
[diagram p9: board, inner layer Route2]
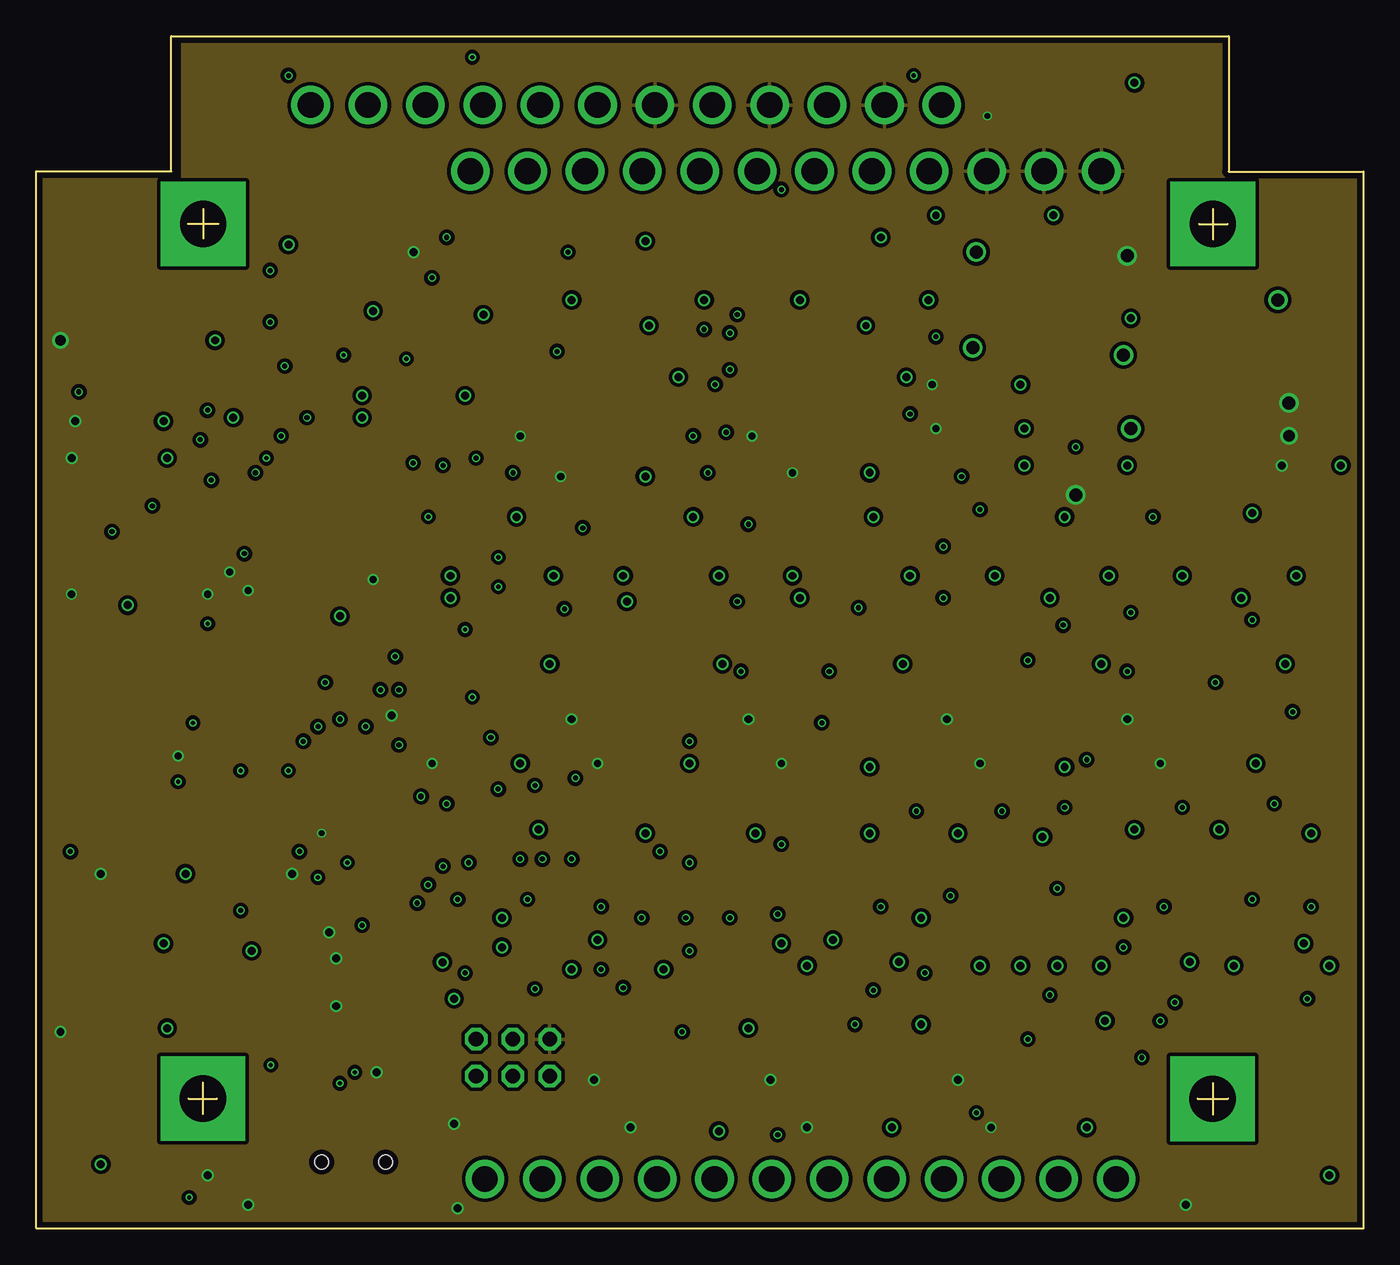
[diagram p10: board, inner layer Route15]
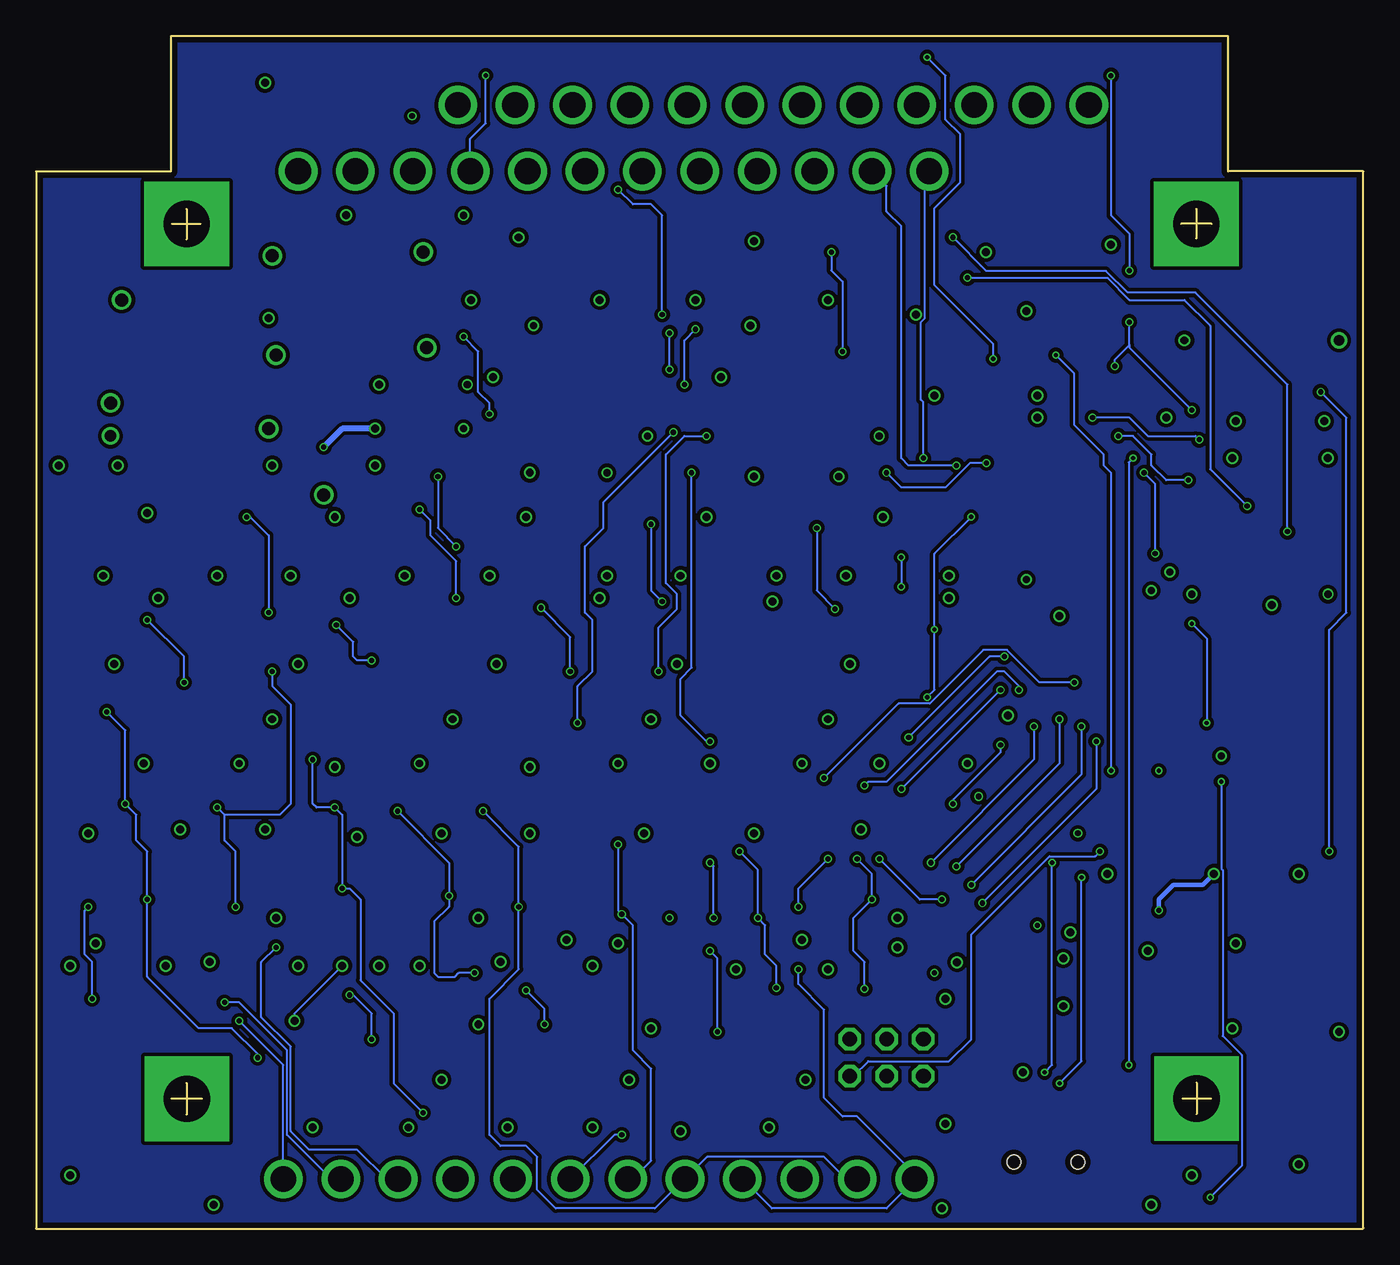
[diagram p11: board, bottom side, seen from below]

Size 91.64 x 82.35 mm. Coordinates in mm from the lower left corner, seen from the top.
Outline: 11.53,70.43 11.53,68.38
Outline: 10.49,69.39 12.6,69.39
Outline: 10.52,8.97 12.5,8.97
Outline: 11.51,10.08 11.51,7.92
Outline: 81.25,10.06 81.25,7.87
Outline: 80.19,8.97 82.3,8.97
Outline: 81.25,70.41 81.25,68.33
Outline: 80.29,69.37 82.27,69.37
Outline: 0,0.03 0,73.02 9.32,73.02 9.32,82.35 82.35,82.35 82.35,73 91.64,73 91.64,0 0.03,0 0,0.03
Copper layers (1*2*15*16): Top 0.035559375mm / dielectric 0.17018125mm / Route2 0.01778125mm / dielectric 47mil / Route15 0.01778125mm / dielectric 0.17018125mm / Bottom 0.035559375mm
Design rules "oshpark-4layer": minimum track width 5mil, minimum drill 10mil, track to track 5mil, track to pad 5mil, pad to pad 5mil, via to via 5mil, smd to smd 5mil, copper to edge 15mil, drill to drill 6mil, minimum pad ring 4mil, minimum via ring 4mil, stop-mask expansion 2.5mil, vias tented up to drill 0mil, thermal gap 10mil

### Footprints (pad centres in the part's own frame; a part is rotated, then mirrored left to right if it is on the bottom)
CAP_5750 = smd 0.406 x 5.41: 1 -3.048,0; 2 3.048,0
CAP_01 = smd 0.508 x 0.559: 1 -0.47,0; 2 0.47,0
CAP_GRM219R61A106KE44D = smd 0.711 x 1.245: 1 -0.851,0; 2 0.851,0
YAG_CC0805 = smd 0.965 x 1.448: 1 -0.826,0; 2 0.826,0
CC0805N = smd 1.067 x 1.219: 1 -0.826,0; 2 0.826,0
DIODE_600V_3A = smd 2.18 x 2.21: 1 -1.857,0; 2 1.857,0
SOT-223 = smd 0.914 x 1.6: 1 -2.3,-3.2; 2 0,-3.2; 3 2.3,-3.2
L1812 = smd 1.9 x 3.4: 1 -1.95,0; 2 1.95,0
FRAM_MB85RS2MTA_FPT-8P-M09 = smd 1.473 x 0.559: 1 -2.819,1.905; 2 -2.819,0.635; 3 -2.819,-0.635; 4 -2.819,-1.905; 5 2.819,-1.905; 6 2.819,-0.635; 7 2.819,0.635; 8 2.819,1.905
3,2-PAD-SQUARE = drill 3.2 pad 5.842 square: B3,2 0,0
TQFP32-08 = smd 1.27 x 0.559: 1 -4.293,2.8; 2 -4.293,2; 3 -4.293,1.2; 4 -4.293,0.4; 5 -4.293,-0.4; 6 -4.293,-1.2; 7 -4.293,-2; 8 -4.293,-2.8; 17 4.293,-2.8; 18 4.293,-2; 19 4.293,-1.2; 20 4.293,-0.4; 21 4.293,0.4; 22 4.293,1.2; 23 4.293,2; 24 4.293,2.8 | smd 0.559 x 1.27: 9 -2.8,-4.293; 10 -2,-4.293; 11 -1.2,-4.293; 12 -0.4,-4.293; 13 0.4,-4.293; 14 1.2,-4.293; 15 2,-4.293; 16 2.8,-4.293; 25 2.8,4.293; 26 2,4.293; 27 1.2,4.293; 28 0.4,4.293; 29 -0.4,4.293; 30 -1.2,4.293; 31 -2,4.293; 32 -2.8,4.293
SSOP28 = smd 0.381 x 2.032: 1 0,0; 2 0.65,0; 3 1.3,0; 4 1.95,0; 5 2.6,0; 6 3.25,0; 7 3.9,0; 8 4.55,0; 9 5.2,0; 10 5.85,0; 11 6.5,0; 12 7.15,0; 13 7.8,0; 14 8.45,0; 15 8.45,7.112; 16 7.8,7.112; 17 7.15,7.112; 18 6.5,7.112; 19 5.85,7.112; 20 5.2,7.112; 21 4.55,7.112; 22 3.9,7.112; 23 3.25,7.112; 24 2.6,7.112; 25 1.95,7.112; 26 1.3,7.112; 27 0.65,7.112; 28 0,7.112
WIREWRAPPOST = drill 1.778 pad 2.54: 1 0,0; 2 3.962,0; 3 7.925,0; 4 11.887,0; 5 15.85,0; 6 19.812,0; 7 23.774,0; 8 27.737,0; 9 31.699,0; 10 35.662,0; 11 39.624,0; 12 43.586,0
2X03 = drill 1.016 pad 1.55 octagon: 1 -2.54,-1.27; 2 -2.54,1.27; 3 0,-1.27; 4 0,1.27; 5 2.54,-1.27; 6 2.54,1.27
SOT-23 = smd 0.561 x 1.321: D 0,0.945; G -1.025,-0.945; S 1.025,-0.945
OSCILLATOR = smd 5.588 x 2.108: 1 2.798,1.05 | smd 5.6 x 2.1: 2 12.36,1.04
RC0603N = smd 0.762 x 0.813: 1 -0.775,0; 2 0.775,0
R_8-M = smd 2.489 x 0.61: 1 -2.413,1.905; 2 -2.413,0.635; 3 -2.413,-0.635; 4 -2.413,-1.905; 5 2.413,-1.905; 6 2.413,-0.635; 7 2.413,0.635; 8 2.413,1.905
SOT23-5 = smd 0.6 x 1.2: EN 0.95,-1.306; GND 0,-1.306; IN -0.95,-1.306; NC/ADJ 0.95,1.306; OUT -0.95,1.306
SOP65P500X110-8N = smd 1.2 x 0.45: 1 -2.175,0.975; 2 -2.175,0.325; 3 -2.175,-0.325; 4 -2.175,-0.975; 5 2.175,-0.975; 6 2.175,-0.325; 7 2.175,0.325; 8 2.175,0.975
USB-MINI-B_2 = smd 0.508 x 2.54: 1 0,0; 2 0.8,0; 3 1.6,0; 4 2.4,0; 5 3.2,0 | smd 2.286 x 1.778: 6 -2.717,5.948; 7 -2.717,0.36; 8 5.918,0.36; 9 5.918,5.948 | hole 0.95: -0.6,2.9; 3.8,2.9

### Placement (x,y rotation side)
C1  80.92,55.25 180 top
C2  88.29,52.71 0 top
C3  81.18,61.6 180 top
C4  65.18,58.29 0 top
C5  65.18,55.25 0 top
C6  13.61,53.47 0 top
C7  5.99,53.21 0 top
C8  6.25,61.34 0 top
C9  5.99,55.75 0 top
C10  7.26,24.51 0 top
C11  4.47,43.05 270 top
C12  4.47,17.91 90 top
C13  14.88,24.51 180 top
C14  6.5,33.91 180 top
C15  21.23,44.32 270 top
C16  54.76,32.13 0 top
C17  55.02,52.2 0 top
C18  39.01,52.2 0 top
C19  44.35,6.98 0 top
C20  69.49,6.98 0 top
C21  56.03,6.98 0 top
C22  42.32,32.13 0 top
C23  30.38,32.13 0 top
C24  68.22,32.13 0 top
C25  81.18,32.13 0 top
CR1  88.04,64.13 90 top
CR2  70.26,64.13 180 top
CR3  4.22,9.78 90 top
F1  12.09,17.91 270 top
F2  54.76,37.21 0 top
F3  55.02,56.77 0 top
F4  39.01,56.77 0 top
F5  43.84,12.07 0 top
F6  56.03,12.32 0 top
F7  68.73,12.32 0 top
F8  42.32,37.21 0 top
F9  30.38,37.21 0 top
F10  68.22,37.21 0 top
F11  81.18,37.21 0 top
H1  81.23,8.97 0 top
H2  81.25,69.39 0 top
H3  11.51,8.99 0 top
H4  11.53,69.39 0 top
IC1  13.36,44.32 0 top
IC2  24.54,14.1 90 top
J$1  18.95,77.6 0 top
J$2  74.57,3.43 180 top
J$3  73.56,73.02 180 top
JP1  32.92,11.81 0 top
Q1  19.96,62.36 180 top
Q2  27.33,62.36 180 top
Q3  2.95,27.56 0 top
Q4  84.99,26.54 180 top
Q5  78.89,26.54 180 top
Q6  72.8,26.54 180 top
Q7  54.51,26.54 180 top
Q8  60.6,26.54 180 top
Q9  66.7,26.54 180 top
Q10  54.76,48.13 180 top
Q11  39.27,67.44 180 top
Q12  55.02,67.44 180 top
Q13  31.65,26.54 180 top
Q14  39.27,26.54 180 top
Q15  46.89,26.54 180 top
Q16  42.32,48.13 180 top
Q17  30.38,48.39 180 top
Q18  68.22,48.13 180 top
Q19  81.18,48.13 180 top
R1  17.17,56.77 90 top
R2  24.54,56.77 90 top
R3  20.98,56.77 270 top
R4  28.09,56.77 270 top
R5  13.11,33.66 180 top
R6  58.83,44.32 270 top
R7  59.84,63.37 270 top
R8  44.35,63.37 270 top
R9  46.38,20.7 270 top
R10  62.64,20.7 270 top
R11  76.61,20.7 270 top
R12  45.36,44.32 270 top
R13  26.82,44.32 270 top
R14  72.29,44.32 270 top
R15  84.99,44.32 270 top
R16  85.75,20.7 90 top
R17  79.65,20.7 90 top
R18  70.51,20.7 90 top
R19  89.31,20.7 90 top
R20  82.7,20.7 90 top
R21  73.56,20.7 90 top
R22  49.68,20.7 90 top
R23  56.79,20.7 90 top
R24  65.18,20.7 90 top
R25  53.24,20.7 90 top
R26  59.59,20.7 90 top
R27  67.97,20.7 90 top
R28  50.19,44.32 270 top
R29  34.7,63.37 270 top
R30  50.95,63.37 270 top
R31  30.38,20.7 270 top
R32  33.93,20.7 90 top
R33  40.28,20.7 90 top
R34  39.01,44.32 270 top
R35  33.93,44.32 270 top
R36  64.67,44.32 270 top
R37  77.11,44.32 270 top
R38  54.76,44.32 90 top
R39  39.27,63.37 90 top
R40  55.02,63.37 90 top
R41  28.09,20.7 90 top
R42  36.98,20.7 90 top
R43  43.33,20.7 90 top
R44  42.32,44.32 90 top
R45  30.38,44.32 90 top
R46  68.22,44.32 90 top
R47  81.18,44.32 90 top
U1  22,70.23 90 top
U2  71.78,53.98 0 top
U3  22.76,29.84 0 top
U4  70.51,78.1 0 top
U5  84.73,2.67 0 top
USB1  23.52,7.49 180 top

### Tracks (layer width: path | path; a pad name or v marks a point on that pad's centre or on a via)
3.3V  (via drill 0.35, 0.55)
  Top 0.305: R9.1 47.89,21.48 v47.9,21.46 | IC2.17 14.85,21.25 v14.12,21.97
  Top 0.406: U1.1 19.96,67.94 v17.42,67.94 | Q11.G 40.48,68.2 v42.06,68.2 | R8.1 44.36,64.13 v46.13,64.13 | R29.1 34.71,64.13 v36.98,64.13 | Q1.G 21.06,63.37 v23.27,63.37 | Q2.G 28.54,63.12 v30.89,63.12 | Q12.G 56.11,68.45 v58.32,68.45 | R7.1 59.86,64.13 v61.62,64.13 | R30.1 50.97,64.13 v52.73,64.13 | F4.8 41.96,58.8 v44.35,58.8 | F3.8 57.96,58.8 v60.1,58.8 | C17.2 v57.56,52.2 | C18.2 40.12,51.94 v42.06,51.94 | Q16.G 43.41,49.15 v45.36,49.15 | Q17.G 31.59,49.15 v33.17,49.15 | R13.1 26.84,45.09 v28.6,45.09 | R35.1 33.95,45.09 v35.71,45.09 | R34.1 39.03,45.09 v40.54,45.09 | R12.1 45.38,45.09 v47.14,45.09 | R28.1 50.2,45.09 v52.22,45.09 | R6.1 58.84,45.09 v60.35,45.09 | R36.1 64.68,45.09 v66.19,45.09 | Q18.G 69.32,49.15 v71.02,49.15 | Q10.G 55.86,49.15 v57.81,49.15 | R14.1 72.3,45.09 v74.07,45.09 | R37.1 77.13,45.09 v79.15,45.09 | R15.1 85,45.09 86.85,45.09 | 86.85,45.09 v87.02,45.09 | Q19.G 82.53,49.4 v83.97,49.4 83.97,47.97 86.85,45.09 | F5.8 46.79,13.84 v49.17,13.84 | F6.8 58.98,14.1 v61.11,14.1 | F7.8 71.68,14.35 v73.81,14.35 | C20.2 v72.54,6.98 | C21.2 v59.08,6.98 | C19.2 45.45,6.73 v47.14,6.73 | C23.2 v33.43,32.13 | Q13.G 32.74,27.56 v34.7,27.56 | Q14.G 40.48,27.3 v42.06,27.3 | C22.2 v45.11,32.13 | Q15.G 48.1,27.3 v49.68,27.3 | F9.8 33.32,38.99 v35.46,38.99 | F8.8 45.26,38.99 v47.4,38.99 | F2.8 57.71,38.99 v59.84,38.99 | C16.2 55.87,31.88 v57.56,31.88 | F10.8 71.17,38.99 v73.56,38.99 | F11.8 84.12,38.99 v86.26,38.99 | C25.2 v84.23,32.13 | Q4.G 86.2,27.3 v88.04,27.3 | Q5.G 79.99,27.56 v81.69,27.56 | Q6.G 73.89,27.56 v75.84,27.56 | Q9.G 68.16,27.05 v69.49,27.05 | Q8.G 61.81,27.3 v63.65,27.3 | Q7.G 55.72,27.3 v57.56,27.3 | C24.2 69.33,31.88 v71.02,31.88
  Top 0.406: R16.1 85.99,19.68 v87.53,19.68 | R31.1 30.39,21.46 v32.16,21.46 | R32.1 33.44,19.43 v32.16,19.43 | R33.1 40.27,19.94 v38.76,19.94 | R22.1 49.92,19.68 v51.46,19.68 | R23.1 56.78,19.94 v55.02,19.94 | R10.1 62.62,21.46 v61.11,21.46 | R24.1 v65.18,18.16 | R18.1 v70.51,18.16 | R11.1 76.59,21.46 v75.08,21.46 | R17.1 v79.65,18.41 | C5.2 v68.22,55.25 | R1.1 v13.61,56.01 | R2.1 24.52,56.01 v22.5,56.01 | C10.2 v10.31,24.51 | U2.OUT 70.83,54.93 v71.78,53.98
  Route2 0.127: v73.81,14.35 73.81,14.86 72.25,16.42
  Route2 0.305: v34.7,27.56 33.22,26.08 33.2,26.08 32.16,25.04 v32.16,21.46
  Route2 0.406: v71.02,49.15 73.05,49.15 74.57,50.67 74.57,51.18 v71.78,53.98
  Bottom 0.127: v73.81,14.35 73.81,14.86 v70.51,18.16
  Bottom 0.305: v14.12,21.97 14.12,22.73 13.11,23.75 11.07,23.75 v10.31,24.51
  Bottom 0.406: v68.22,55.25 70.51,55.25 v71.78,53.98
  pour Route2 (isolate 0.254): -0.1,0.13 91.34,0.13 91.34,72.52 81.94,72.52 81.94,82.17 10.06,82.17 10.06,72.52 -0.1,72.52
5V  (via drill 0.4, 0.5, 0.55)
  Top 0.203: U3.8 25.59,30.82 v26.57,29.84
  Top 0.305: IC2.4 24.64,15.95 25.59,15.95 25.66,15.88 v28.85,15.88 | IC1.4 7.66,44.72 7.26,44.32 7.26,43.08 7.3,43.05
  Top 0.406: C2.2 v90.1,52.71 90.32,52.71 | CR3.1 4.47,7.67 v4.47,4.44 | C4.2 v67.97,58.29 | IC1.6 9,43.05 7.3,43.05 v6.32,43.05 6.25,43.05 | 17.69,42.29 IC1.18 20.95,42.32 v20.98,42.29 | R45.1 30.37,43.56 v28.6,43.56 | R44.1 42.08,43.31 v40.79,43.31 | R38.1 54.75,43.56 v52.73,43.56 | R46.1 68.24,43.56 v70,43.56 | R47.1 81.19,43.56 v83.21,43.56 | R41.1 28.09,18.41 28.07,18.41 v28.06,18.4 | R42.1 v36.98,17.91 | R43.1 v43.33,17.91 | R25.1 v53.24,18.16 | v59.59,18.41 R26.1 | R27.1 v67.97,18.16 | v73.56,18.16 R21.1 | R20.1 v82.7,18.16 | R19.1 v89.31,18.16 | R40.1 55.26,62.36 v57.3,62.36 | R39.1 39.51,62.36 v42.32,62.36 | v62.13,69.98 v62.13,69.97 v70.26,69.97 v70.26,69.98 | IC2.20 17.37,19.25 16.35,19.25 16.28,19.18 v14.88,19.18 | C9.2 v8.79,55.75 | C7.2 v9.04,53.21 | C8.2 v12.34,61.34 | R3.1 22.49,57.54 v22.5,57.53 | R4.1 29.6,57.54 v29.62,57.53 | U4.8 75.8,79.08 v75.84,79.12 | v89.31,3.68 86.95,3.68 U5.8
  Top 0.61: CR2.2 v70.26,69.97 | U2.EN 72.77,52.71 v75.34,52.71 | U2.IN 70.79,52.71 v68.22,52.71 | C3.2 76.86,62.87 v75.59,62.87
  Route2 0.406: 62.13,69.72 58.83,66.42 58.83,63.88 v57.3,62.36 49.38,62.36 48.19,61.16 47.62,61.16 47.22,61.57 47.22,61.98 46.41,62.79 45.84,62.79 45.41,62.36 v42.32,62.36 37.49,57.53 v29.62,57.53 v22.5,57.53 21.16,58.88 16.89,58.88 16.46,59.31 12.34,59.31 | 62.13,69.72 v62.13,69.98 | v6.32,43.05 11.49,43.05 11.51,43.03 20.24,43.03 v20.98,42.29 27.33,42.29 | 62.13,69.72 62.94,68.91 62.94,61.03 64.22,59.75 66.51,59.75 v67.97,58.29 69.05,57.22 69.05,54.91 68.22,54.08 v68.22,52.71 | 70.27,69.99 71.82,71.54 71.82,73.75 75.84,77.77 v75.84,79.12 | 70.27,69.99 v70.26,69.98 | 70,43.9 v70,43.56 | 70,43.9 70,50.93 v68.22,52.71 | v90.1,52.71 83.21,45.81 v83.21,43.56 77.8,48.97 77.8,49.43 75.34,51.9 v75.34,52.71 74.02,52.71 72.06,54.66 71.5,54.66 69.54,52.71 v68.22,52.71 | v12.34,61.34 12.34,59.31 | 12.34,59.31 v8.79,55.75 8.79,53.47 v9.04,53.21 | 28.06,16.67 24.46,20.27 22.22,20.27 21.82,20.67 21.82,21.24 22.22,21.64 26.44,21.64 27,22.2 27,22.76 26.39,23.37 26.39,24.03 26.57,24.21 v26.57,29.84 26.57,31.79 26.55,31.81 26.55,41.51 27.33,42.29 | v28.85,15.88 | v28.06,18.4 28.06,16.67 | 28.06,16.67 v28.85,15.88 | v28.85,15.88 34.95,15.88 v36.98,17.91 38.05,17.91 38.73,17.22 39.3,17.22 39.98,17.91 v43.33,17.91 52.98,17.91 v53.24,18.16 59.33,18.16 v59.59,18.41 64.27,18.41 64.84,18.98 67.15,18.98 v67.97,18.16 69.35,18.16 70.17,17.34 70.85,17.34 71.67,18.16 v73.56,18.16 78.75,18.16 79.31,17.59 79.99,17.59 80.56,18.16 v82.7,18.16 v89.31,18.16 v89.31,3.68 | v4.47,4.44 8.99,8.96 8.99,10.03 14.88,15.93 14.88,19.11 | 14.88,19.11 v14.88,19.18 | v28.85,15.88 21.38,15.88 21.07,16.19 17.81,16.19 14.88,19.11
  Route2 0.406: JP1.2 30.38,14.35 v28.85,15.88 | 27.33,42.29 v28.6,43.56 40.54,43.56 v40.79,43.31 47.44,43.31 48.13,42.62 51.79,42.62 v52.73,43.56 61.67,43.56 62.35,42.88 68.98,42.88 70,43.9 | v75.59,62.87 75.59,64.68 70.27,69.99
AREF
  Top 0.127: IC1.20 17.72,43.85 C15.2
CS1  (via drill 0.35)
  Top 0.127: IC1.32 10.56,48.14 12.09,46.61 v14.38,46.61 | v15.14,52.2 16.15,52.2 16.92,51.44 24.58,51.44 v26.03,52.88 | v32.92,52.2 32.92,51.69 33.68,50.93 62.89,50.93 v63.91,51.94 | v62.64,47.12 55.12,47.12 54.76,46.76
  Top 0.152: Q10.D 54.76,46.76 R38.2
  Bottom 0.127: v14.38,46.61 14.38,51.44 v15.14,52.2 | v26.03,52.88 27.15,52.88 28.85,51.18 31.9,51.18 v32.92,52.2 | v63.91,51.94 63.91,48.39 v62.64,47.12
CS1_3V  (via drill 0.35)
  Top 0.127: Q10.S 49.61,49.08 v49.17,48.64 | v48.41,43.31 49.95,43.31 R28.2
  Top 0.152: R28.2 50.19,40.87 F2.1
  Bottom 0.127: v49.17,48.64 49.17,44.07 v48.41,43.31
CS2  (via drill 0.35)
  Top 0.152: Q11.D R39.2 38.49,64.15 35.71,66.93 28.6,66.93 v27.33,65.66 | v8.03,49.91 8.03,48.16 IC1.1
  Bottom 0.152: v27.33,65.66 17.68,65.66 16.15,64.13 12.34,64.13 10.57,62.36 10.57,52.45 v8.03,49.91
CS2_3V  (via drill 0.35)
  Top 0.152: Q11.S 37.67,68.38 v36.73,67.44 | v35.96,60.58 v35.97,60.58 | v35.96,60.58 34.95,60.58 34.7,60.83 R29.2 | F3.1 48.54,58.67 v47.9,59.31 | v47.9,61.85 47.65,61.85 46.66,60.86 41.69,60.86 40.85,60.02 36.52,60.02 v35.96,60.58
  Bottom 0.152: v36.73,67.44 36.73,66.17 35.97,65.41 v35.97,60.58 | v47.9,59.31 v47.9,61.85
CS3  (via drill 0.35)
  Top 0.152: 55.02,66.38 Q12.D | 55.02,66.38 R40.2 | IC1.2 7.04,46.32 v5.23,48.13 | v28.35,68.45 35.46,68.45 35.97,68.45 37.74,70.23 50.95,70.23 52.98,68.2 52.98,67.44 54,66.42 54.97,66.42 55.02,66.38
  Bottom 0.152: v5.23,48.13 5.23,58.29 11.58,64.64 16.27,64.64 17.76,66.14 26.03,66.14 v28.35,68.45
CS3_3V  (via drill 0.35)
  Top 0.152: F4.1 39.9,58.67 41.81,60.58 50.19,60.58 50.95,61.34 R30.2 48.93,62.6 v48.41,63.12 | v51.46,71.75 51.46,70.12 52.55,69.03 53.34,69.03 Q12.S
  Bottom 0.152: v48.41,63.12 48.41,69.98 49.17,70.74 50.44,70.74 v51.46,71.75
CS4  (via drill 0.35)
  Top 0.127: IC1.9 10.56,37.22 12.85,34.93 17.17,34.93 v18.44,33.66 | v26.31,22.48 27.09,22.48 R41.2 28.09,21.72 v29.11,22.73 | v33.43,25.53 31.72,25.53 Q13.D
  Bottom 0.127: v18.44,33.66 18.44,30.35 v26.31,22.48 | v29.11,22.73 30.63,22.73 v33.43,25.53
CS4_3V  (via drill 0.35)
  Top 0.127: F5.1 37.36,13.97 35.97,15.37 32.66,15.37 30.75,17.28 | 30.75,17.28 30.63,17.4 30.63,19.67 R31.2 | Q13.S 27.26,27.49 23.01,23.24 23.01,21.46 v22.5,20.95 | v29.62,17.65 30.38,17.65 30.75,17.28
  Route2 0.127: v29.62,17.65 28.74,18.53 28.74,18.68 26.46,20.95 v22.5,20.95
CS5  (via drill 0.35)
  Top 0.127: IC1.10 11.36,36.78 12.91,35.23 18.9,35.23 v19.46,34.67 | v27.08,23.75 34.71,23.75 R42.2 38.27,21.48 v39.01,22.22 | v36.98,25.53 39.2,25.53 Q14.D
  Bottom 0.127: v19.46,34.67 19.46,31.37 v27.08,23.75 | v39.01,22.22 39.01,23.49 v36.98,25.53
CS5_3V  (via drill 0.35)
  Top 0.127: R32.2 v33.93,22.73 | Q14.S 36.91,27.49 v34.95,25.53 | F6.1 51.84,14.22 50.95,15.11 40.03,15.11 39.14,14.22 37.47,14.22 36.07,15.62 35.38,15.62 v34.44,16.56
  Bottom 0.127: v33.93,22.74 v33.93,22.73 | v33.93,22.74 33.93,24.51 v34.95,25.53 | v34.44,16.56 34.44,18.41 35.2,19.18 35.2,21.47 v33.93,22.74
CS6  (via drill 0.35)
  Top 0.127: IC1.11 12.16,36.34 13.01,35.49 20.67,35.49 v20.98,35.18 | v28.09,25.02 29.11,24 40.81,24 R43.2 44.84,21.48 v44.86,21.46 | v45.11,25.27 46.56,25.27 Q15.D
  Bottom 0.127: v20.98,35.18 20.98,32.13 v28.09,25.02 | v44.86,21.46 44.86,25.02 v45.11,25.27
CS6_3V  (via drill 0.35)
  Top 0.127: R33.2 41.8,21.48 v41.81,21.46 | v43.08,26.04 44.86,26.04 45.86,27.04 Q15.S | F7.1 65.81,14.22 64.41,15.62 41.55,15.62 v40.54,16.64
  Bottom 0.127: v43.08,26.04 41.81,24.77 v41.81,21.46 41.3,20.95 41.3,18.92 40.54,18.16 v40.54,16.64
CS7
  Top 0.127: IC1.23 17.69,46.36 19.46,46.36 20.98,47.88 25.81,47.88 26.57,47.12 28.6,47.12 29.87,45.85 39.52,45.85 40.86,47.19 Q16.D R44.2
CS7_3V  (via drill 0.35)
  Top 0.152: 39.01,43.4 R34.2 | 39.01,43.4 39.01,39.6 F8.1 | Q16.S 38.44,49.08 v37.74,48.39 | v36.47,42.8 38.42,42.8 39.01,43.4
  Bottom 0.152: v37.74,48.39 37.74,44.07 v36.47,42.8
CS8  (via drill 0.3)
  Top 0.127: IC1.24 18.66,48.13 26.06,48.13 26.75,47.44 Q17.D 31.47,46.36 v31.9,46.36 | v31.9,44.32 31.13,45.1 R45.2
  Bottom 0.127: v31.9,46.36 v31.9,44.32
CS8_3V  (via drill 0.3)
  Top 0.127: Q17.S 29.17,49.15 v27.08,49.15 | v29.62,41.38 30.53,42.29 33.17,42.29 33.93,43.05 R35.2 | F9.1 28.36,38.32 28.37,38.32 29.99,36.7 v30.12,36.7
  Bottom 0.127: v27.08,49.15 29.62,46.61 v29.62,41.38 29.62,37.21 v30.12,36.7
CS9
  Top 0.127: IC1.25 25.27,48.62 25.3,48.64 25.55,48.64 27.33,50.42 62.89,50.42 66.19,47.12 68.22,47.12 68.22,47.11
  Top 0.152: Q18.D 68.22,47.11 R46.2
CS9_3V  (via drill 0.35)
  Top 0.127: F10.1 65.41,42.81 R36.2 v62.65,43.55 v62.64,43.56 | v65.18,49.66 66.62,49.66 Q18.S
  Bottom 0.127: v62.64,43.56 62.64,46.1 64.41,47.88 64.41,48.9 v65.18,49.66
CS10
  Top 0.127: IC1.26 15.36,49.62 16.41,50.67 70.45,50.67 72.89,48.23 79.85,48.23 81.18,46.9
  Top 0.152: Q19.D 81.18,46.9 R47.2
CS10_3V  (via drill 0.35)
  Top 0.127: F11.1 78.36,42.3 77.19,43.47 | 77.19,43.47 R37.2 | Q19.S 77.19,49.08 v77.11,49.15 | v75.59,42.55 76.27,42.55 77.19,43.47
  Bottom 0.127: v77.11,49.15 76.86,49.15 75.59,47.88 v75.59,42.55
D0/RX  (via drill 0.35)
  Top 0.127: Q2.D 26.57,60.65 26.57,57.02 27.6,55.99 R4.2 26.84,54.74 v16.92,54.74 | IC1.30 12.16,51.62 v12.09,51.69
  Bottom 0.127: v12.09,51.69 13.61,51.69 14.63,52.71 14.63,53.47 15.9,54.74 v16.92,54.74
D0/RX_3.3V
  Top 0.127: U1.3 22.76,67.69 22.76,64.9 24.35,63.3 Q2.S | Q2.S | R2.2 25.03,58.04 25.81,58.04 26.3,58.54 Q2.S
D1/TX  (via drill 0.35)
  Top 0.127: Q1.D 19.71,61.16 19.71,56.52 20.23,55.99 R3.2 18.71,55.99 v18.69,56.01 | v11.33,54.48 11.33,48.65 IC1.31
  Bottom 0.127: v18.69,56.01 16.15,56.01 14.88,54.74 11.58,54.74 v11.33,54.48
D1/TX_3.3V
  Top 0.127: 18.99,63.36 Q1.S | 18.99,63.36 20.03,64.39 20.73,64.39 21.36,65.02 U1.2 | R1.2 18.99,59.37 18.99,63.36
D8  (via drill 0.35)
  Top 0.127: IC1.12 12.96,36.85 14.07,35.74 21.69,35.74 v22.76,34.67 | v29.87,25.27 30.89,24.26 50.46,24.26 | 50.46,24.26 R25.2 | 50.46,24.26 53.17,24.26 Q7.D
  Bottom 0.127: v22.76,34.67 22.76,32.39 v29.87,25.27
D8_3V  (via drill 0.35)
  Top 0.127: Q7.S 52.41,27.49 v51.46,26.54 | v51.21,21.72 49.92,21.72 R22.2 | J$2.10 40.72,3.43 42.24,1.91 49.28,1.91 J$2.7
  Bottom 0.127: v51.46,26.54 51.46,21.97 51.26,21.77 | 51.26,21.77 v51.21,21.72 | J$2.7 50.44,3.43 49.17,4.7 49.17,11.05 50.44,12.32 50.44,20.95 51.26,21.77
D9  (via drill 0.35)
  Top 0.127: IC1.13 13.76,36.61 14.38,35.99 22.45,35.99 v25.04,33.4 | v28.35,29.34 56.79,29.34 58.57,27.56 58.57,26.8 59.84,25.53 60.53,25.53 Q8.D 59.59,24.58 R26.2
  Bottom 0.127: v25.04,33.4 25.04,32.89 28.35,29.59 v28.35,29.34
D9_3V  (via drill 0.35)
  Top 0.127: R23.2 57.57,21.48 v58.32,22.22 | v60.78,28.83 60.78,28.69 Q8.S
  Bottom 0.127: v60.78,28.83 58.32,26.37 v58.32,22.22 58.32,17.91 60.35,15.88 60.35,6.48 59.59,5.71 57.81,5.71 57.05,4.95 57.05,2.67 55.78,1.4 48.92,1.4 46.89,3.43 J$2.8 45.31,4.95 37.24,4.95 35.71,3.43 J$2.11
D10  (via drill 0.35)
  Top 0.127: IC1.14 14.56,37.28 15.59,36.25 24.08,36.25 v25.04,37.21 | v31.9,30.35 33.17,30.35 33.93,29.59 62.89,29.59 64.67,27.81 64.67,26.54 65.68,25.53 66.63,25.53 | 66.63,25.53 Q9.D | R27.2 67.97,24.19 66.63,25.53
  Bottom 0.127: v25.04,37.21 v31.9,30.35
D10_3V  (via drill 0.35)
  Top 0.127: R24.2 64.66,21.48 v63.14,22.99 | v66.7,28.83 66.7,28.51 Q9.S | v39.01,17.91 40.79,17.91 42.82,15.88 55.52,15.88 57.3,17.65 v61.37,17.65
  Bottom 0.127: v66.7,28.83 63.14,25.27 v63.14,22.99 63.14,22.22 64.16,21.21 64.16,17.65 63.91,17.4 62.71,17.4 62.46,17.65 v61.37,17.65 | J$2.9 40.84,1.4 32.92,1.4 30.99,3.33 J$2.12 30.99,3.79 34.95,7.75 35.97,7.75 37.24,9.02 37.24,15.11 39.01,16.89 v39.01,17.91
D11/MOSI  (via drill 0.35)
  Top 0.127: IC1.15 15.36,37.5 16.36,36.5 23.07,36.5 v23.77,37.21 | v34.44,30.61 35.46,30.61 36.22,29.84 67.97,29.84 70.76,27.05 70.76,25.78 71.27,25.27 72.47,25.27 72.61,25.41 | 72.61,25.41 Q6.D | 72.61,25.41 73.56,24.47 R21.2 75.08,19.95 v75.08,19.43 | JP1.4 32.92,12.32 34.19,11.05 34.19,6.98 35.71,5.46 50.19,5.46 v51.21,6.48 | J$2.6 56.57,3.43 58.09,4.95 59.36,4.95 61.16,3.15 61.16,2.8 62.06,1.91 63.32,1.91 64.84,3.43 J$2.3
  Bottom 0.127: v23.77,37.21 23.77,37.47 24.79,38.48 25.3,38.48 32.92,30.86 34.19,30.86 v34.44,30.61 | J$2.3 67.46,3.43 69.49,5.46 72.8,5.46 74.07,6.73 74.07,12.57 76.1,14.61 76.1,18.41 v75.08,19.43 | v51.21,6.48 51.71,6.48 J$2.6
D12/MISO  (via drill 0.35)
  Top 0.127: IC1.16 16.16,38.22 17.63,36.76 22.05,36.76 v24.79,39.5 | v31.39,33.91 33.17,33.91 36.98,30.1 74.57,30.1 77.11,27.56 77.11,26.29 77.88,25.53 78.82,25.53 | 78.82,25.53 Q5.D | 81.74,21.48 R20.2 | 81.74,21.48 80.91,21.48 79.65,22.73 79.65,24.69 78.82,25.53 | v78.64,15.62 79.15,15.62 81.43,17.91 81.43,21.17 81.74,21.48 | JP1.1 30.38,7.24 32.92,4.7 32.92,2.67 34.19,1.4 56.69,1.4 J$2.5 60.17,3.43 61.95,1.65 67.03,1.65 68.8,3.43 J$2.2
  Bottom 0.127: v24.79,39.5 25.81,39.5 v31.39,33.91 | J$2.2 71.27,3.43 74.32,6.48 74.32,12.32 77.62,15.62 v78.64,15.62
D13/SCK  (via drill 0.35)
  Top 0.127: IC1.17 17.65,40.03 v19.96,37.72 | v37.24,31.11 38,30.35 80.92,30.35 82.96,28.32 82.96,26.04 83.21,25.78 84.81,25.78 Q4.D | v77.62,14.35 86.26,14.35 v87.78,15.88 | v88.04,22.22 88.04,22.84 88.49,23.29 | JP1.3 32.92,6.73 34.44,5.21 60.91,5.21 J$2.4 64.48,3.43 66.01,4.95 71.24,4.95 72.77,3.43 J$2.1
  Top 0.152: R19.2 89.31,22.48 88.49,23.29 88.29,23.49 87.09,23.49 Q4.D
  Bottom 0.127: v37.24,31.11 32.09,36.26 29.94,36.26 26.24,39.96 24.6,39.96 22.35,37.72 v19.96,37.72 | J$2.1 74.57,11.3 v77.62,14.35 | v87.78,15.88 87.78,18.41 88.29,18.92 88.29,21.97 v88.04,22.22
GND  (via drill 0.4, 0.5, 0.55, 0.75, 0.8, 0.9)
  Top 0.203: U3.4 20.58,28.18 v19.71,27.3 | U4.4 68.04,76.83 v65.68,76.83
  Top 0.305: IC2.21 17.45,18.67 v20.73,18.67 22.91,18.67 23.48,18.1 24.43,18.1 IC2.7 | IC2.26 17.45,15.37 20.22,15.37 | IC2.25 17.51,16.13 19.46,16.13 20.22,15.37 | 20.22,15.37 v20.73,15.37 | IC2.18 17.53,20.49 18.48,20.49 18.52,20.45 v20.22,20.45 | C14.1 8.6,32.64 v9.8,32.64
  Top 0.406: U1.4 24.28,67.44 v26.06,67.44 | C2.1 v86,52.71 | C10.1 v4.47,24.51 | C13.1 v17.68,24.51 | USB1.7 26.34,7.24 v28.85,7.24 | USB1.6 26.39,1.4 v29.11,1.4 | USB1.9 17.5,1.65 v14.63,1.65 | USB1.8 14.15,3.68 v11.84,3.68 | C12.1 3.2,13.59 v1.68,13.59 | USB1.1 v23.52,10.79 | F7.4 65.79,10.29 v63.65,10.29 | F6.4 53.09,10.29 v50.7,10.29 | F5.4 40.89,10.29 v38.51,10.29 | C19.1 v41.05,6.98 | C21.1 v53.24,6.98 | F9.4 27.43,35.43 v24.54,35.43 | F8.4 39.37,35.18 v36.98,35.18 | F2.4 51.82,35.18 v49.17,35.18 | F10.4 65.28,35.18 v62.89,35.18 | F11.4 78.23,35.18 v75.34,35.18 | C7.1 v2.44,53.21 | C9.1 v2.69,55.75 | F4.4 36.07,54.74 v33.43,54.74 | F3.4 52.07,54.74 v49.43,54.74 | C5.1 v62.13,55.25 | C4.1 v61.87,58.29 | IC1.5 9.18,43.82 v11.84,43.82 | IC1.3 9.18,45.41 9.87,45.41 9.94,45.34 v13.36,45.34 | IC1.21 17.54,44.61 16.85,44.61 16.31,44.07 v14.63,44.07 | C11.1 4.41,43.82 v2.44,43.82 | C15.1 21.27,44.83 v23.27,44.83 | C25.1 v77.62,32.13 | C24.1 v65.18,32.13 | C16.1 v51.46,32.13 | C22.1 v38.76,32.13 | C23.1 v27.33,32.13 | C18.1 37.91,51.94 v36.22,51.94 | C17.1 v52.22,52.2 | C20.1 v65.94,6.98 | U5.4 79.44,1.69 v79.4,1.65
  Top 0.508: C1.1 86,55.25 v86.51,54.74
  Top 0.61: C8.1 v1.68,61.34 | CR2.1 72.71,67.18 v75.34,67.18 | U2.GND v71.78,50.67 | C3.1 86.51,59.31 v86.51,57.02
  pour Route15 (isolate 0.254): -0.1,0.13 91.34,0.13 91.34,72.52 82.45,72.52 82.45,82.17 10.06,82.17 10.06,72.52 -0.1,72.52
MISO_3V  (via drill 0.35)
  Top 0.127: F9.2 28.36,37.05 28.37,37.05 29.23,36.2 30.89,36.2 31.9,37.21 36.98,37.21 37.62,37.85 F8.2 39.62,37.72 41.81,37.72 42.32,37.21 49.68,37.21 50.32,37.85 | 50.32,37.85 F2.2 52.07,37.72 54,37.72 54.51,37.21 63.4,37.21 64.03,37.85 F10.2 65.53,37.72 68.73,37.72 69.24,37.21 76.1,37.21 | 76.1,37.21 76.73,37.85 F11.2 | F5.2 41.15,12.57 44.09,12.57 44.6,12.07 49.43,12.07 50.32,12.95 F6.2 53.34,12.83 56.79,12.83 57.3,12.32 63.91,12.32 64.54,12.95 65.83,12.95 | 65.83,12.95 F7.2 | F4.2 36.32,57.28 37.59,57.28 | 37.59,57.28 39.78,57.28 40.28,56.77 50.19,56.77 50.83,57.4 F3.2 | R17.2 78.63,21.48 v77.88,22.22 77.88,17.91 75.59,15.62 70.76,15.62 69.24,14.1 68.22,14.1 67.21,13.08 65.96,13.08 65.83,12.95 | v79.15,29.08 78.38,29.08 77.88,28.57 Q5.S | 76.1,37.21 76.1,37.72 v75.34,38.48 | 50.32,37.85 49.3,37.85 v48.67,38.48 | v45.36,54.74 43.59,54.74 42.82,55.5 39.37,55.5 37.59,57.28
  Bottom 0.127: v77.88,22.22 77.88,26.04 78.64,26.8 78.64,28.57 | 79.07,29 78.64,28.57 | 79.07,29 v79.15,29.08 | v75.34,38.48 75.34,37.47 74.07,36.2 74.07,29.34 74.83,28.57 78.64,28.57 | 78.64,28.57 79.07,29 | v48.67,38.48 48.67,41.53 47.4,42.8 47.4,43.82 48.16,44.58 48.16,53.47 46.89,54.74 v45.36,54.74
MOSI_3V  (via drill 0.35)
  Top 0.127: F9.5 34.59,33.91 35.97,33.91 | 35.97,33.91 43.08,33.91 44.48,35.31 F8.5 46.53,33.91 55.27,33.91 56.67,35.31 F2.5 58.98,33.91 68.22,33.91 69.62,35.31 F10.5 72.44,33.91 72.54,33.91 | 72.54,33.91 80.67,33.91 82.07,35.31 F11.5 | F5.5 47.8,9.02 56.54,9.02 57.94,10.41 F6.5 60.21,9.06 | 60.21,9.06 60.25,9.02 68.73,9.02 70.13,10.41 F7.5 | 43.2,53.49 F4.5 | 43.2,53.49 43.23,53.47 56.03,53.47 57.43,54.86 F3.5 | R18.2 v70.51,23.49 | v71.02,29.08 71.02,28.24 Q6.S | v72.54,32.39 72.54,33.91 | 35.97,33.91 44.86,33.91 v45.11,33.66 | v46.38,52.2 44.5,52.2 43.2,53.49 | v64.92,8 61.26,8 60.21,9.06
  Bottom 0.127: v72.54,32.39 72.54,29.34 72.29,29.08 v71.02,29.08 70.51,28.57 v70.51,23.49 70,23.49 69.24,22.73 69.24,17.14 66.95,14.86 66.95,10.03 v64.92,8 | v45.11,33.66 45.36,33.66 47.14,35.43 47.14,37.97 46.38,38.73 v46.38,52.2
N$1
  Top 0.127: USB1.5 17.02,10.79 16.08,10.79 12.09,14.78 F1.2
N$2  (via drill 0.35)
  Top 0.127: F2.7 55.4,37.85 v54.76,38.48 | v56.79,42.88 58.15,42.88 R6.2
  Bottom 0.127: v54.76,38.48 54.76,40.84 v56.79,42.88
N$3
  pour Top (isolate 0.254): -0.1,0.13 91.34,0.13 91.34,72.52 82.45,72.52 82.7,82.17 10.06,82.17 9.8,72.52 -0.1,72.52
N$4
  pour Bottom (isolate 0.254): -0.1,0.13 91.59,0.13 91.59,73.02 81.94,73.02 81.94,82.17 9.3,82.17 9.3,72.77 -0.1,72.77
N$7  (via drill 0.35)
  Top 0.152: F4.7 46,57.4 v46.89,58.29 | v46.13,62.1 44.84,62.1 R8.2
  Bottom 0.152: v46.89,58.29 46.89,61.34 v46.13,62.1
N$8  (via drill 0.35)
  Top 0.127: F6.7 57.68,12.95 v56.54,14.1 | v57.81,16.46 61.7,16.46 62.64,17.4 R10.2
  Bottom 0.127: v56.54,14.1 56.54,15.19 v57.81,16.46
N$10  (via drill 0.35)
  Top 0.152: F3.7 59.21,57.4 v60.35,56.26 | v62.13,61.6 60.85,61.6 R7.2
  Bottom 0.152: v60.35,56.26 60.35,57.02 61.11,57.79 61.11,60.58 v62.13,61.6
N$15  (via drill 0.35)
  Top 0.127: F7.7 68.61,12.95 v68.48,13.08 | v70,16.13 75.59,16.13 76.35,16.89 76.35,19.67 R11.2
  Bottom 0.127: v68.48,13.08 68.48,14.86 69.75,16.13 v70,16.13
N$16
  Top 0.127: R13.2 29.17,41.2 29.17,41.19 29.36,41.01 29.36,38.99 30.51,37.85 F9.7
N$17  (via drill 0.35)
  Top 0.127: F5.7 45.49,12.7 v44.6,13.59 | v45.11,19.18 45.63,19.18 R9.2
  Bottom 0.127: v44.6,13.59 44.6,18.67 v45.11,19.18
N$18  (via drill 0.35)
  Top 0.127: F11.7 81.56,37.85 v81.43,37.72 | v83.97,42.04 83.97,42.53 R15.2
  Bottom 0.127: v81.43,37.72 81.43,39.5 v83.97,42.04
N$19
  Top 0.152: F8.7 43.46,37.85 42.57,38.73 42.57,40.75 R12.2
N$20  (via drill 0.35)
  Top 0.127: F10.7 69.88,37.85 v68.48,39.24 | v70.92,41.68 70.92,42.18 R14.2
  Bottom 0.127: v68.48,39.24 69.49,39.24 69.75,39.5 69.75,40.51 v70.92,41.68
N$21  (via drill 0.3)
  Top 0.127: C6.2 14.34,53.21 v15.9,53.21 | v16.2,11.3 16.45,11.05 20.73,11.05 22.25,12.57 22.25,13.84 23.15,14.75 IC2.2
  Bottom 0.127: v15.9,53.21 16.2,52.92 v16.2,11.3
N$22  (via drill 0.3)
  Top 0.127: USB1.3 22,7.57 v22,10.79 | v21.49,25.27 20.91,24.7 19.14,24.7 17.42,22.99 IC2.15
  Bottom 0.127: v22,10.79 21.49,11.3 v21.49,25.27
N$23  (via drill 0.3)
  Top 0.127: USB1.4 20.98,7.63 v20.98,10.03 | v19.46,24.26 19.96,23.75 19.96,22.48 19.38,21.9 IC2.16
  Bottom 0.127: v20.98,10.03 19.46,11.56 v19.46,24.26
RESET  (via drill 0.35)
  Top 0.127: IC1.29 13.14,48.8 C6.1 13.11,53.51 13.11,54.74 11.84,56.01 v11.84,56.52 | J$1.6 J$1.5 34.8,77.75 32.92,79.63 v17.42,79.63 | v16.15,66.17 v16.15,62.61 | v18.19,26.04 v2.36,26.04 | v2.95,57.79 15.39,57.79 v17.17,59.56
  Bottom 0.127: v17.42,79.63 17.42,69.98 16.15,68.71 v16.15,66.17 | 16.15,61.02 v16.15,62.61 | 16.15,61.02 16.15,60.83 v11.84,56.52 | JP1.5 35.2,10.54 34.19,11.56 28.6,11.56 27.08,13.08 27.08,20.31 21.67,25.71 18.51,25.71 v18.19,26.04 | v2.36,26.04 2.36,41.35 1.17,42.55 1.17,56.01 v2.95,57.79 | v17.17,59.56 17.17,60 16.15,61.02
RX+
  Top 0.127: J$1.1 18.44,77.09 18.44,74.3 U1.8
RX-
  Top 0.127: J$1.2 21.36,76.05 U1.7
SCK_3V  (via drill 0.35)
  Top 0.127: F9.6 33.83,35.94 42.32,35.94 42.95,36.58 F8.6 45.26,36.45 49.68,36.45 50.19,35.94 55.27,35.94 55.91,36.58 | 55.91,36.58 F2.6 57.71,36.45 63.4,36.45 63.91,35.94 68.48,35.94 69.11,36.58 F10.6 71.17,36.45 76.35,36.45 76.86,35.94 81.94,35.94 82.58,36.58 83.91,36.58 | 83.91,36.58 F11.6 | F5.6 46.79,11.3 51.21,11.3 51.46,11.05 56.29,11.05 56.92,11.68 F6.6 58.98,11.56 64.16,11.56 64.67,11.05 68.48,11.05 69.11,11.68 F7.6 76.23,11.68 v76.35,11.81 | F4.6 41.96,56.01 45.45,56.01 | F3.6 55.65,56.13 55.02,55.5 50.7,55.5 50.19,56.01 45.45,56.01 | R16.2 85.23,21.48 v83.97,22.73 | v85.5,29.34 85.5,29.02 Q4.S | v86.77,35.69 86.77,35.94 86.26,36.45 84.04,36.45 83.91,36.58 | 55.91,36.58 v54.25,34.93 | v47.65,54.99 46.47,54.99 45.45,56.01
  Bottom 0.127: v86.77,35.69 85.5,34.42 v85.5,29.34 84.73,28.57 84.73,26.8 83.97,26.04 v83.97,22.73 83.97,17.4 80.42,13.84 78.13,13.84 76.35,12.07 v76.35,11.81 | v54.25,34.93 54.25,37.47 53.24,38.48 53.24,42.04 53.75,42.55 53.75,47.12 52.48,48.39 52.48,50.16 v47.65,54.99
SCL  (via drill 0.35)
  Top 0.127: IC1.28 13.76,49.04 15.9,51.18 26.57,51.18 v28.09,52.71 | J$3.11 34.19,73.02 35.97,71.25 40.08,71.25 J$3.9 41.86,72.97 43.59,71.25 48.01,71.25 J$3.7 51.46,73.02 53.24,71.25 56.29,71.25 57.71,72.67 J$3.5
  Bottom 0.127: v28.09,52.71 31.39,52.71 31.9,53.21 31.9,69.21 32.92,70.23 32.92,72.01 J$3.11
SDA  (via drill 0.35)
  Top 0.127: IC1.27 14.89,48.95 14.89,49.51 16.3,50.93 28.09,50.93 v30.38,53.21 | J$3.12 29.97,73.13 31.9,75.06 35.86,75.06 J$3.10 38.76,73.02 40.79,75.06 43.79,75.06 J$3.8 45.82,73.23 47.65,75.06 51.71,75.06 J$3.6
  Bottom 0.127: v30.38,53.21 30.38,57.08 30.55,57.25 30.55,62.6 30.28,62.87 30.28,72.71 J$3.12
TEMP  (via drill 0.3)
  Top 0.127: U4.1 67.79,79.63 v60.6,79.63 33.28,79.63 33.02,79.88 31.14,79.88 v30.12,80.9 | U3.1 18.23,30.82 v17.42,31.62 | v21.23,60.33 25.3,60.33 v25.55,60.07 | v14.12,31.62 10.57,31.62 v9.8,30.86 | v10.57,2.16 14.18,2.16 14.64,2.62 29.64,2.62 31.12,1.14 76.1,1.14 78.64,3.68 82.52,3.68 U5.1
  Route2 0.127: v17.42,31.62 v14.12,31.62
  Bottom 0.127: J$3.4 61.67,75.26 60.6,76.33 v60.6,79.63 | v17.42,31.62 17.42,52.2 17.93,52.71 17.93,53.47 19.96,55.5 19.96,59.05 v21.23,60.33 | v25.55,60.07 25.55,61.09 29.62,65.15 29.62,70.48 27.84,72.26 27.84,75.56 28.85,76.58 28.85,79.63 v30.12,80.9 | v9.8,30.86 9.8,24.86 9.71,24.76 9.71,13.31 8.39,11.99 8.39,4.33 v10.57,2.16
TX+
  Top 0.127: U1.6 22.76,72.77 22.76,74.55 23.52,75.31 26.06,75.31 26.87,76.12 J$1.3
TX-
  Top 0.127: U1.5 26.06,74.8 29.62,74.8 30.84,76.02 J$1.4
V_USB  (via drill 0.55)
  Top 0.406: 12.09,22.19 C13.2 | 12.09,22.19 F1.1 8.96,19.86 v8.79,19.68 | C12.2 5.7,22.19 12.09,22.19 | CR3.2 6.42,13.84 v9.04,13.84
  Route2 0.406: v9.04,13.84 8.79,14.1 v8.79,19.68
VIN  (via drill 0.9)
  Top 0.61: CR2.3 67.85,67.44 v64.92,67.44 | C1.2 v75.59,55.25 | v64.67,60.83 67.24,60.83 68.45,59.63 72.07,59.63 72.77,60.33 v75.08,60.33 | CR1.1 86.18,64.13 v85.75,64.13
  Route2 0.61: J$1.12 62.53,75.92 63.65,74.8 63.65,68.71 v64.92,67.44 64.92,61.09 v64.67,60.83 | v75.59,55.25 75.08,55.75 v75.08,60.33 81.94,60.33 v85.75,64.13
XTAL1  (via drill 0.3)
  Top 0.127: IC1.7 9.4,41.99 9.78,41.99 9.99,41.78 v11.84,41.78 | 10.76,34.98 v10.82,34.93 | 10.76,34.98 10.57,35.18 6.76,35.18 5.68,34.1 5.68,33.94 | 5.68,33.94 C14.2 | R5.2 11.01,34.98 10.76,34.98 | Q3.1 5.68,28.68 5.68,33.94
  Bottom 0.127: v11.84,41.78 10.82,40.77 v10.82,34.93
XTAL2
  Top 0.127: C11.2 5.3,42.23 5.99,41.53 IC1.8 9.55,41.04 9.55,38.99 10.31,38.23 10.31,37.11 12.75,34.67 13.36,34.67 13.88,34.15 R5.1 15.31,32.23 Q3.2